# EAGLE design PuggleBoard (EAGLE 6.4)
DATABASE: ./bom/puggleboard_BOM.txt; REVISION: 3.0

## Sheet 1 of 8: BEAGLEBONE PINOUT
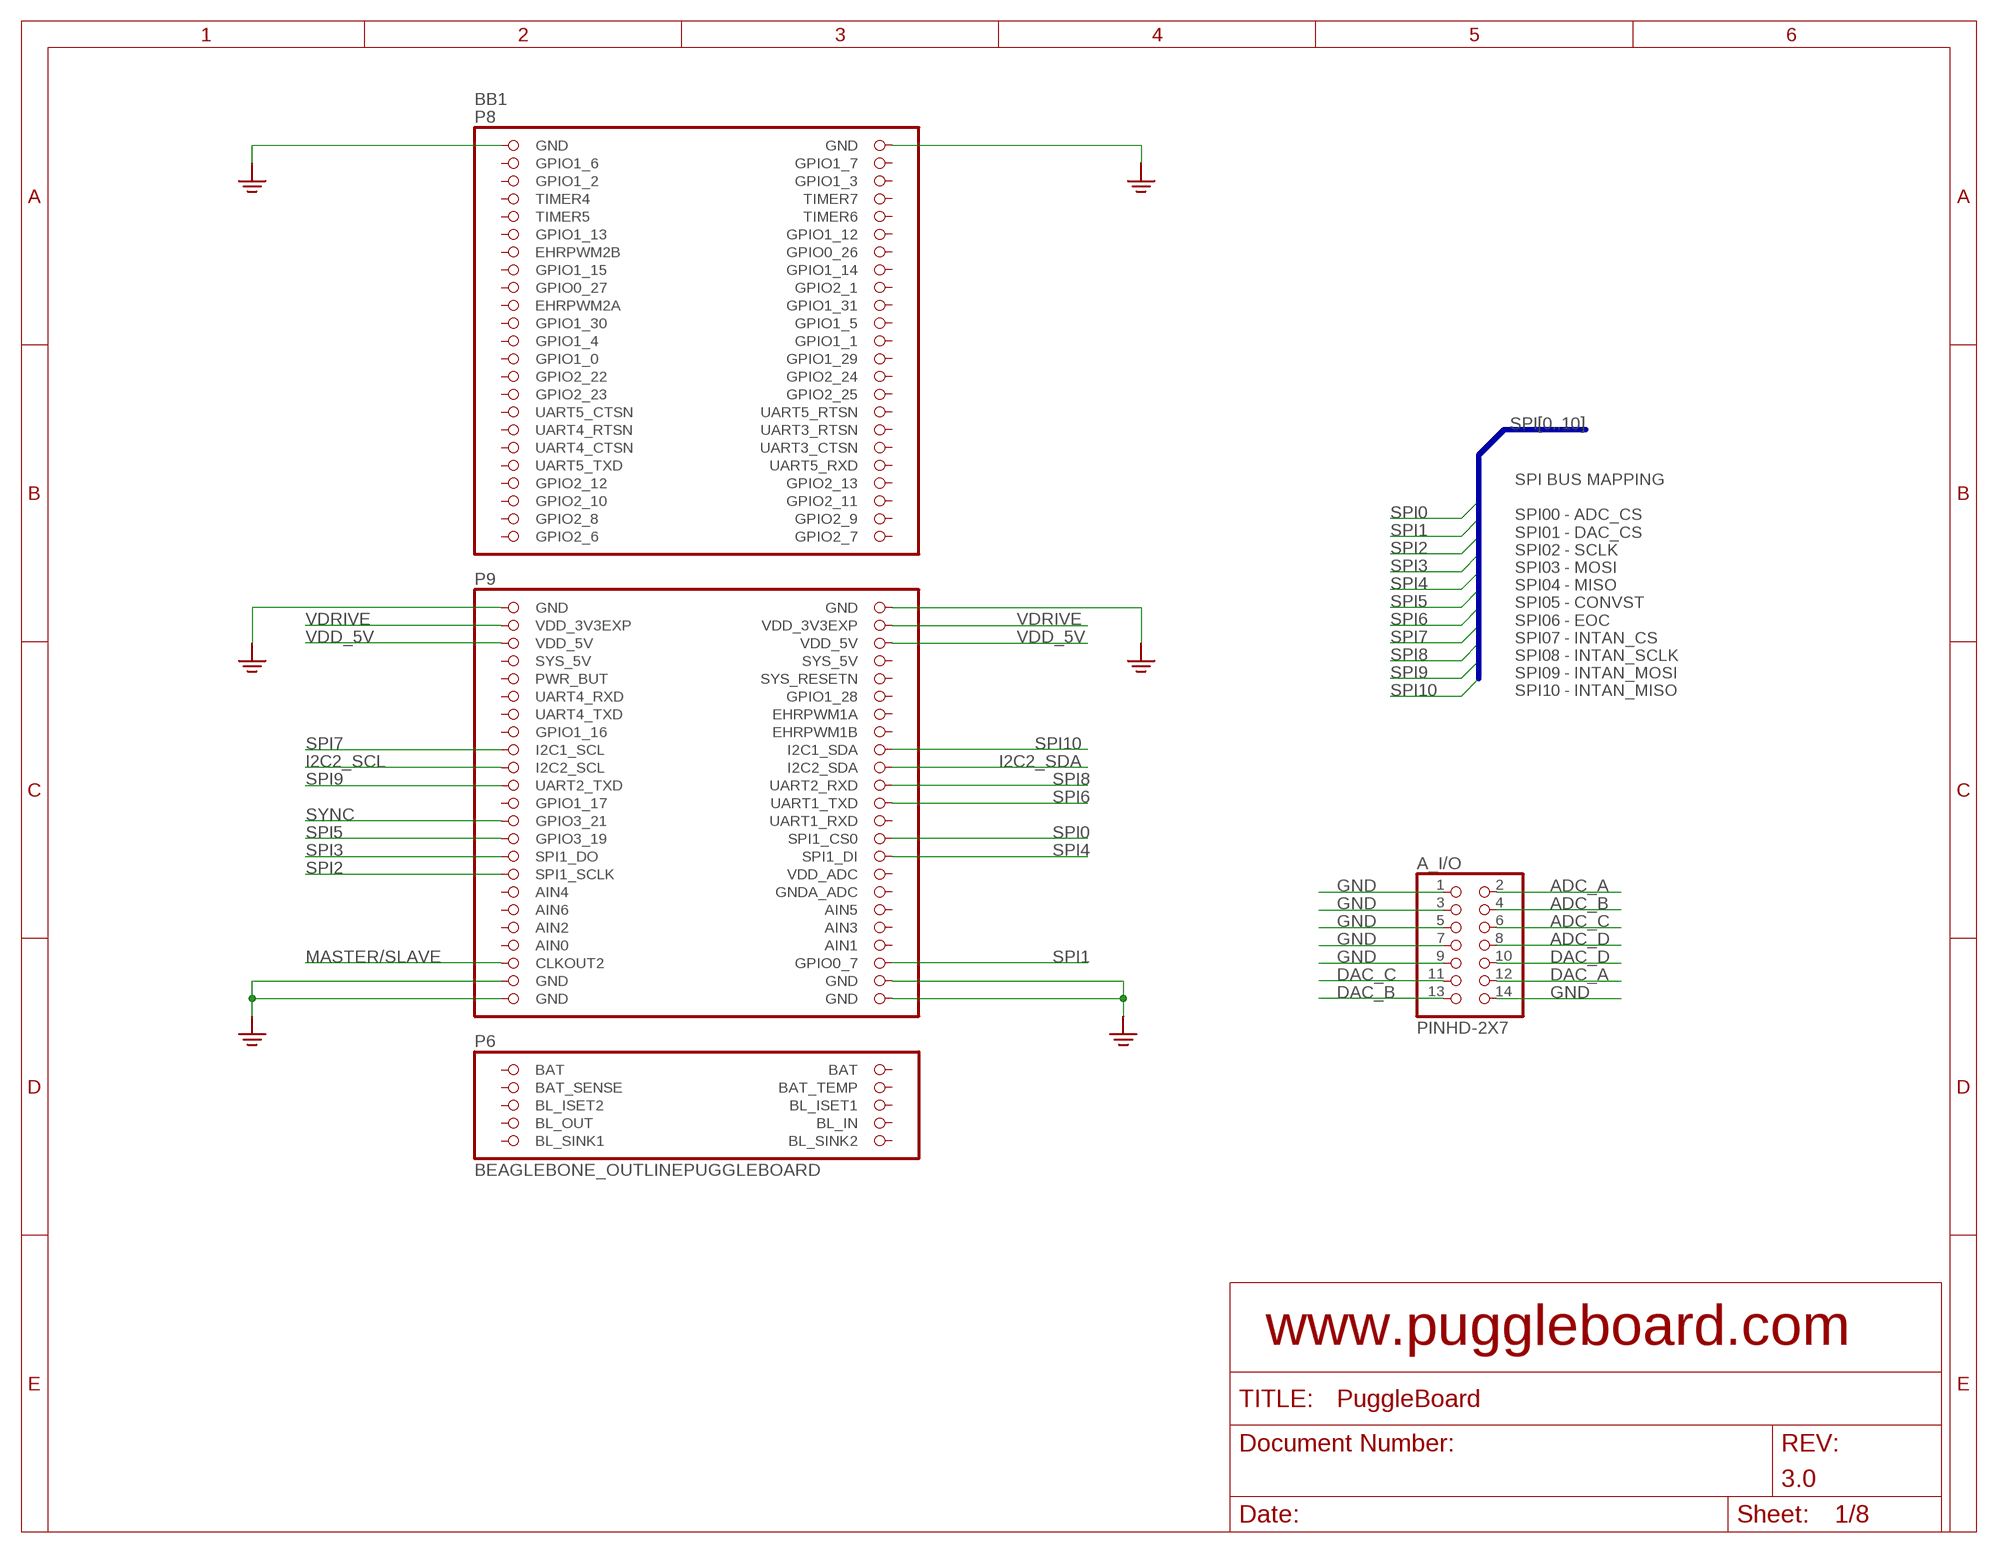
[diagram p0: schematic, sheet 1]

### Parts
A_I/O  PINHD-2X7  [2X07]
BB1  BEAGLEBONE_OUTLINEPUGGLEBOARD  [PUGGLEBOARD_SHIELD]

### Nets
ADC_A: A_I/O.2 ; also sheet 2
ADC_B: A_I/O.4 ; also sheet 2
ADC_C: A_I/O.6 ; also sheet 2
ADC_D: A_I/O.8 ; also sheet 2
DAC_A: A_I/O.12 ; also sheet 3
DAC_B: A_I/O.13 ; also sheet 3
DAC_C: A_I/O.11 ; also sheet 3
DAC_D: A_I/O.10 ; also sheet 3
GND: A_I/O.1 A_I/O.3 A_I/O.5 A_I/O.7 A_I/O.9 A_I/O.14 BB1.1(GND) BB1.2(GND) BB1.47(GND) BB1.48(GND) BB1.89(GND) BB1.90(GND) BB1.91(GND) BB1.92(GND) ; also sheet 2,3,4,5,6,7,8
I2C2_SCL: BB1.65(I2C2_SCL) ; also sheet 8
I2C2_SDA: BB1.66(I2C2_SDA) ; also sheet 8
MASTER/SLAVE: BB1.87(CLKOUT2) ; also sheet 7
SPI0: BB1.74(SPI1_CS0) ; also sheet 2
SPI1: BB1.88(GPIO0_7) ; also sheet 3
SPI2: BB1.77(SPI1_SCLK) ; also sheet 2,3
SPI3: BB1.75(SPI1_DO) ; also sheet 2,3
SPI4: BB1.76(SPI1_DI) ; also sheet 2,3
SPI5: BB1.73(GPIO3_19) ; also sheet 2
SPI6: BB1.70(UART1_TXD) ; also sheet 2
SPI7: BB1.63(I2C1_SCL) ; also sheet 6
SPI8: BB1.68(UART2_RXD) ; also sheet 6
SPI9: BB1.67(UART2_TXD) ; also sheet 6
SPI10: BB1.64(I2C1_SDA) ; also sheet 6
SYNC: BB1.71(GPIO3_21) ; also sheet 7
VDD_5V: BB1.51(VDD_5V) BB1.52(VDD_5V) ; also sheet 4
VDRIVE: BB1.49(VDD_3V3EXP) BB1.50(VDD_3V3EXP) ; also sheet 2,3,4,6,7,8
Unconnected: BB1.3(GPIO1_6) BB1.4(GPIO1_7) BB1.5(GPIO1_2) BB1.6(GPIO1_3) BB1.7(TIMER4) BB1.8(TIMER7) BB1.9(TIMER5) BB1.10(TIMER6) BB1.11(GPIO1_13) BB1.12(GPIO1_12) BB1.13(EHRPWM2B) BB1.14(GPIO0_26) BB1.15(GPIO1_15) BB1.16(GPIO1_14) BB1.17(GPIO0_27) BB1.18(GPIO2_1) BB1.19(EHRPWM2A) BB1.20(GPIO1_31) BB1.21(GPIO1_30) BB1.22(GPIO1_5) BB1.23(GPIO1_4) BB1.24(GPIO1_1) BB1.25(GPIO1_0) BB1.26(GPIO1_29) BB1.27(GPIO2_22) BB1.28(GPIO2_24) BB1.29(GPIO2_23) BB1.30(GPIO2_25) BB1.31(UART5_CTSN) BB1.32(UART5_RTSN) BB1.33(UART4_RTSN) BB1.34(UART3_RTSN) BB1.35(UART4_CTSN) BB1.36(UART3_CTSN) BB1.37(UART5_TXD) BB1.38(UART5_RXD) BB1.39(GPIO2_12) BB1.40(GPIO2_13) BB1.41(GPIO2_10) BB1.42(GPIO2_11) BB1.43(GPIO2_8) BB1.44(GPIO2_9) BB1.45(GPIO2_6) BB1.46(GPIO2_7) BB1.53(SYS_5V) BB1.54(SYS_5V) BB1.55(PWR_BUT) BB1.56(SYS_RESETN) BB1.57(UART4_RXD) BB1.58(GPIO1_28) BB1.59(UART4_TXD) BB1.60(EHRPWM1A) BB1.61(GPIO1_16) BB1.62(EHRPWM1B) BB1.69(GPIO1_17) BB1.72(UART1_RXD) BB1.78(VDD_ADC) BB1.79(AIN4) BB1.80(GNDA_ADC) BB1.81(AIN6) BB1.82(AIN5) BB1.83(AIN2) BB1.84(AIN3) BB1.85(AIN0) BB1.86(AIN1) BB1.93(BAT) BB1.94(BAT) BB1.96(BAT_TEMP) BB1.98(BL_ISET1) BB1.99(BL_ISET2)

### Buses
SPI[0..10]

### Notes on the sheet
- SPI BUS MAPPING
  
  SPI00 - ADC_CS
  SPI01 - DAC_CS
  SPI02 - SCLK
  SPI03 - MOSI
  SPI04 - MISO
  SPI05 - CONVST
  SPI06 - EOC
  SPI07 - INTAN_CS
  SPI08 - INTAN_SCLK
  SPI09 - INTAN_MOSI
  SPI10 - INTAN_MISO

## Sheet 2 of 8: ADC
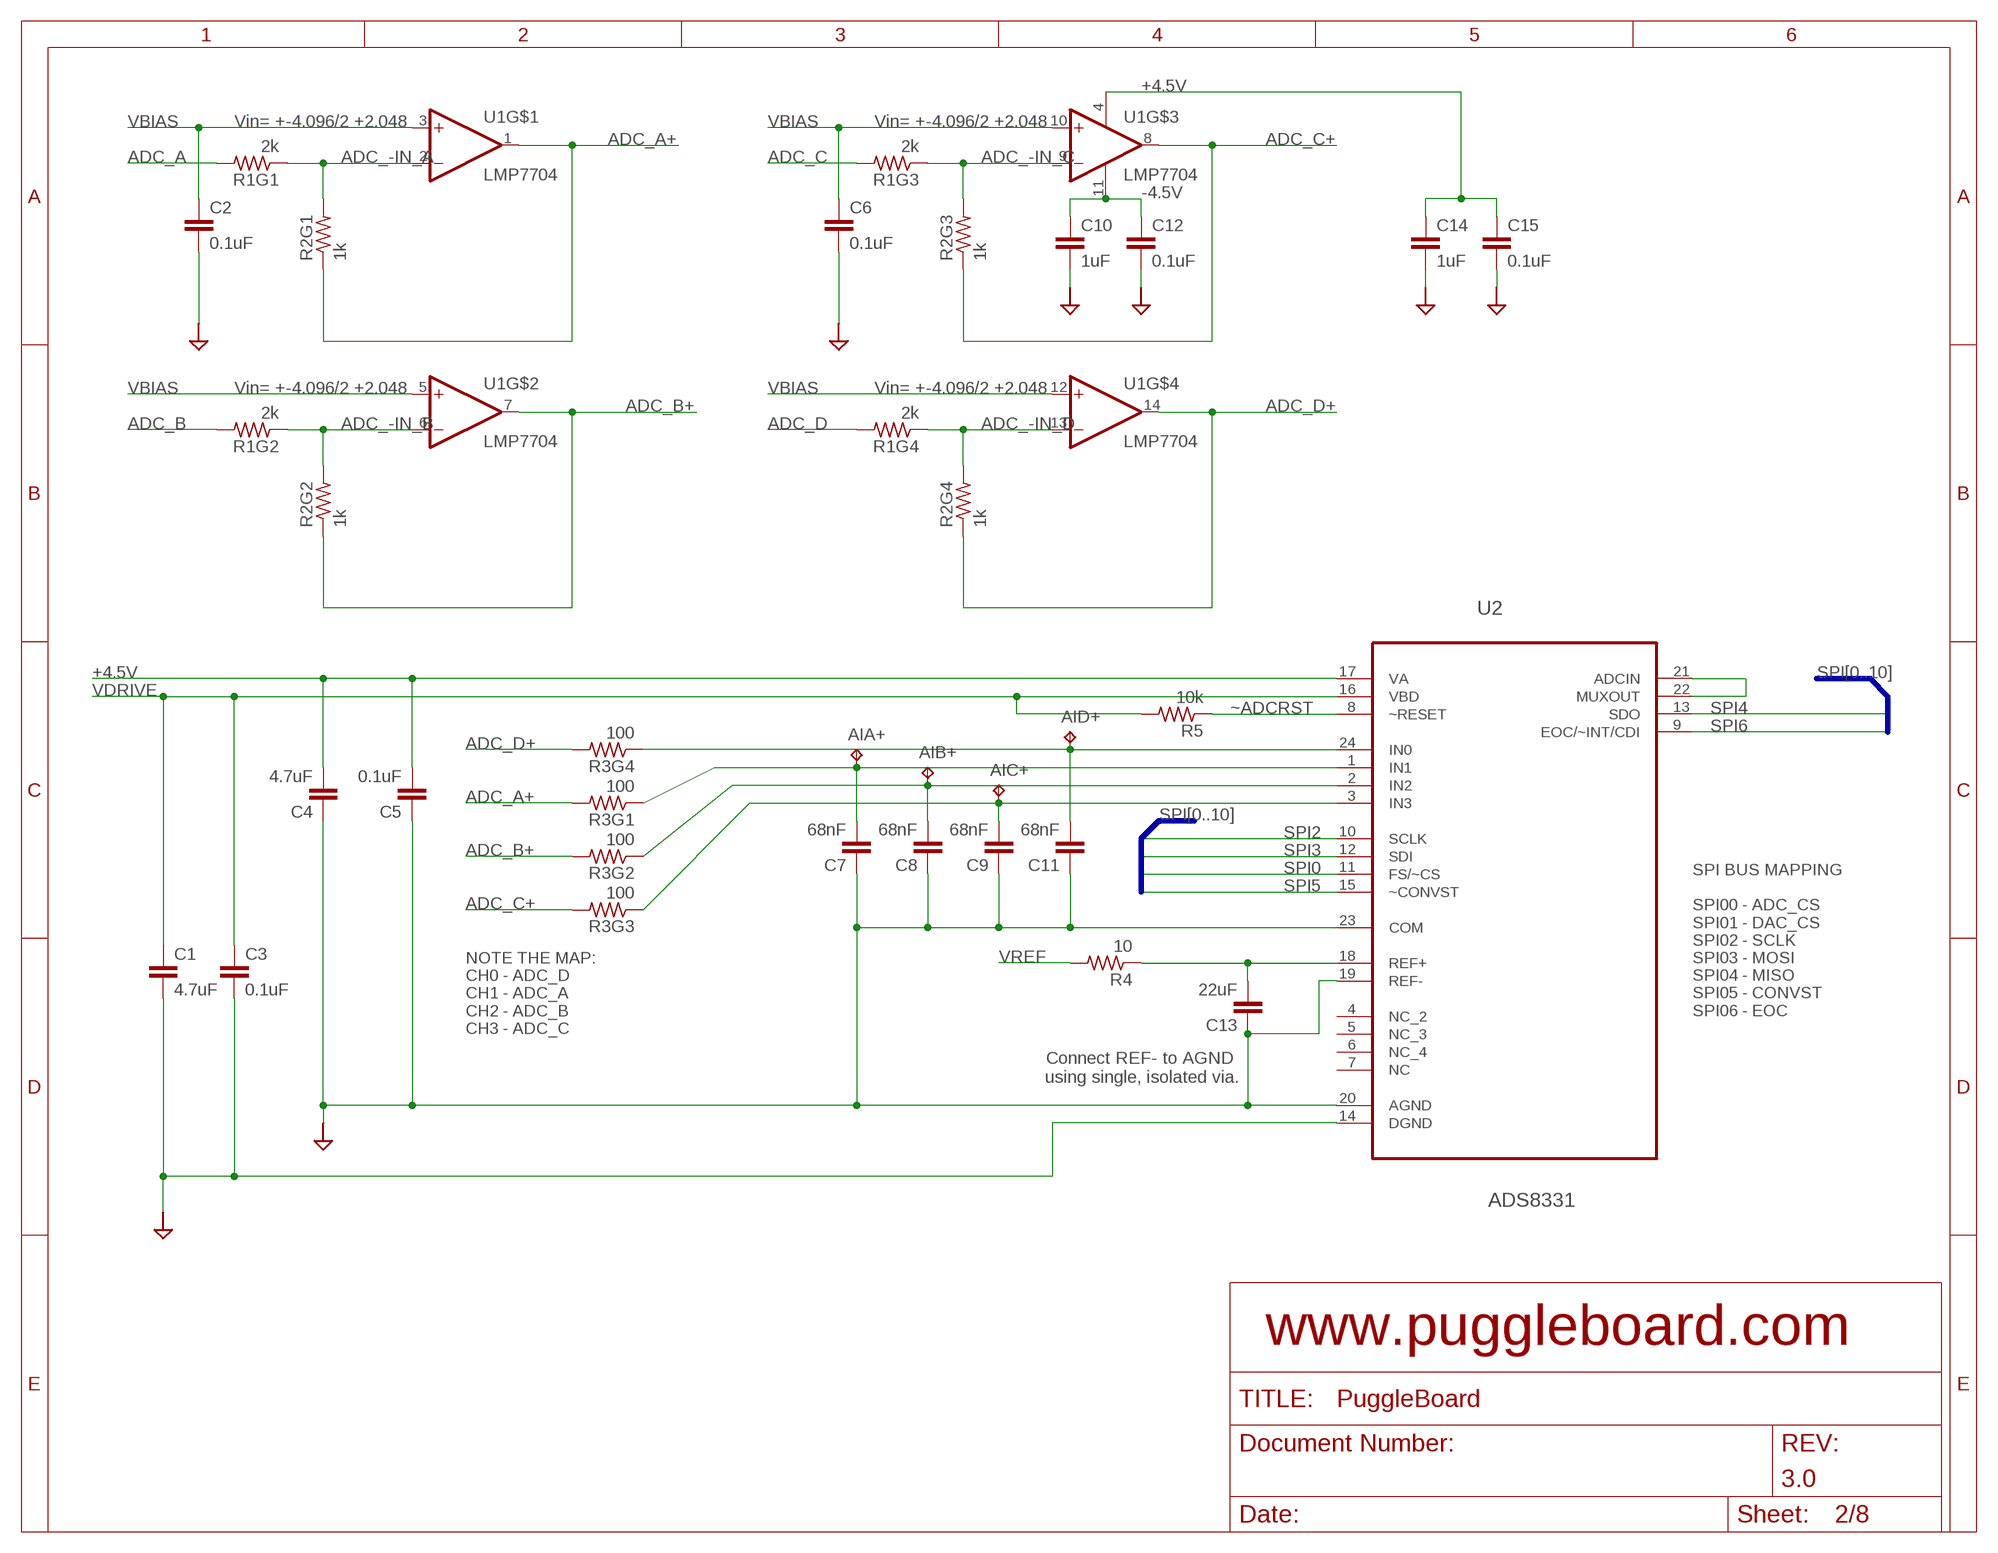
[diagram p1: schematic, sheet 2]

### Parts
AIA+  TPB1,27  [B1,27]
AIB+  TPB1,27  [B1,27]
AIC+  TPB1,27  [B1,27]
AID+  TPB1,27  [B1,27]
C1  4.7uF  C_0603  [0603]
C2  0.1uF  C_0603  [0603]
C3  0.1uF  C_0603  [0603]
C4  4.7uF  C_0603  [0603]
C5  0.1uF  C_0603  [0603]
C6  0.1uF  C_0603  [0603]
C7  68nF  C_0603  [0603]
C8  68nF  C_0603  [0603]
C9  68nF  C_0603  [0603]
C10  1uF  C_0603  [0603]
C11  68nF  C_0603  [0603]
C12  0.1uF  C_0603  [0603]
C13  22uF  C_0805  [0805]
C14  1uF  C_0603  [0603]
C15  0.1uF  C_0603  [0603]
R1  2k  RX4_0612  [RX4_0612]
R2  1k  RX4_0612  [RX4_0612]
R3  100  RX4_0612  [RX4_0612]
R4  10  R_0603  [0603]
R5  10k  R_0603  [0603]
U1  LMP7704  LMP7704MOD  [SOP65P640X120-14N-MOD]
U2  ADS8331  ADS8331IBPW  [SOP65P640X120-24N]

### Nets
+4.5V: C4.2 C5.2 C14.1 C15.1 U1.4(V+) U2.17(VA) ; also sheet 3,4,5
-4.5V: C10.1 C12.1 U1.11(V-) ; also sheet 3,4
ADC_-IN_A: R1.P1 R2.P2 U1.2(-IN)
ADC_-IN_B: R1.P3 R2.P4 U1.6(-IN)
ADC_-IN_C: R1.P5 R2.P6 U1.9(-IN)
ADC_-IN_D: R1.P7 R2.P8 U1.13(-IN)
ADC_A: R1.P2 ; also sheet 1
ADC_A+: R2.P1 R3.P2 U1.1(OUT)
ADC_B: R1.P4 ; also sheet 1
ADC_B+: R2.P3 R3.P4 U1.7(OUT)
ADC_C: R1.P6 ; also sheet 1
ADC_C+: R2.P5 R3.P6 U1.8(OUT)
ADC_D: R1.P8 ; also sheet 1
ADC_D+: R2.P7 R3.P8 U1.14(OUT)
GND: C1.2 C2.2 C3.2 C4.1 C5.1 C6.2 C7.1 C8.1 C9.1 C10.2 C11.1 C12.2 C13.1 C14.2 C15.2 U2.14(DGND) U2.19(REF-) U2.20(AGND) U2.23(COM) ; also sheet 1,3,4,5,6,7,8
N$3: U2.21(ADCIN) U2.22(MUXOUT)
N$16: C13.2 R4.1 U2.18(REF+)
N$40: AIA+.TP C7.2 R3.P1 U2.1(IN1)
N$41: AIB+.TP C8.2 R3.P3 U2.2(IN2)
N$42: AIC+.TP C9.2 R3.P5 U2.3(IN3)
N$43: AID+.TP C11.2 R3.P7 U2.24(IN0)
SPI0: U2.11(FS/~CS) ; also sheet 1
SPI2: U2.10(SCLK) ; also sheet 1,3
SPI3: U2.12(SDI) ; also sheet 1,3
SPI4: U2.13(SDO) ; also sheet 1,3
SPI5: U2.15(~CONVST) ; also sheet 1
SPI6: U2.9(EOC/~INT/CDI) ; also sheet 1
VBIAS: C2.1 C6.1 U1.3(+IN) U1.5(+IN) U1.10(+IN) U1.12(+IN) ; also sheet 5
VDRIVE: C1.1 C3.1 R5.2 U2.16(VBD) ; also sheet 1,3,4,6,7,8
VREF: R4.2 ; also sheet 3,5
~ADCRST: R5.1 U2.8(~RESET)
Unconnected: U2.4(NC_2) U2.5(NC_3) U2.6(NC_4) U2.7(NC)

### Buses
SPI[0..10]

### Notes on the sheet
- Vin= +-4.096/2 +2.048 | Vin= +-4.096/2 +2.048
- Vin= +-4.096/2 +2.048 | Vin= +-4.096/2 +2.048
- SPI BUS MAPPING
  
  SPI00 - ADC_CS
  SPI01 - DAC_CS
  SPI02 - SCLK
  SPI03 - MOSI
  SPI04 - MISO
  SPI05 - CONVST
  SPI06 - EOC
- NOTE THE MAP:
  CH0 - ADC_D
  CH1 - ADC_A
  CH2 - ADC_B
  CH3 - ADC_C
- Connect REF- to AGND 
  using single, isolated via.

## Sheet 3 of 8: DAC
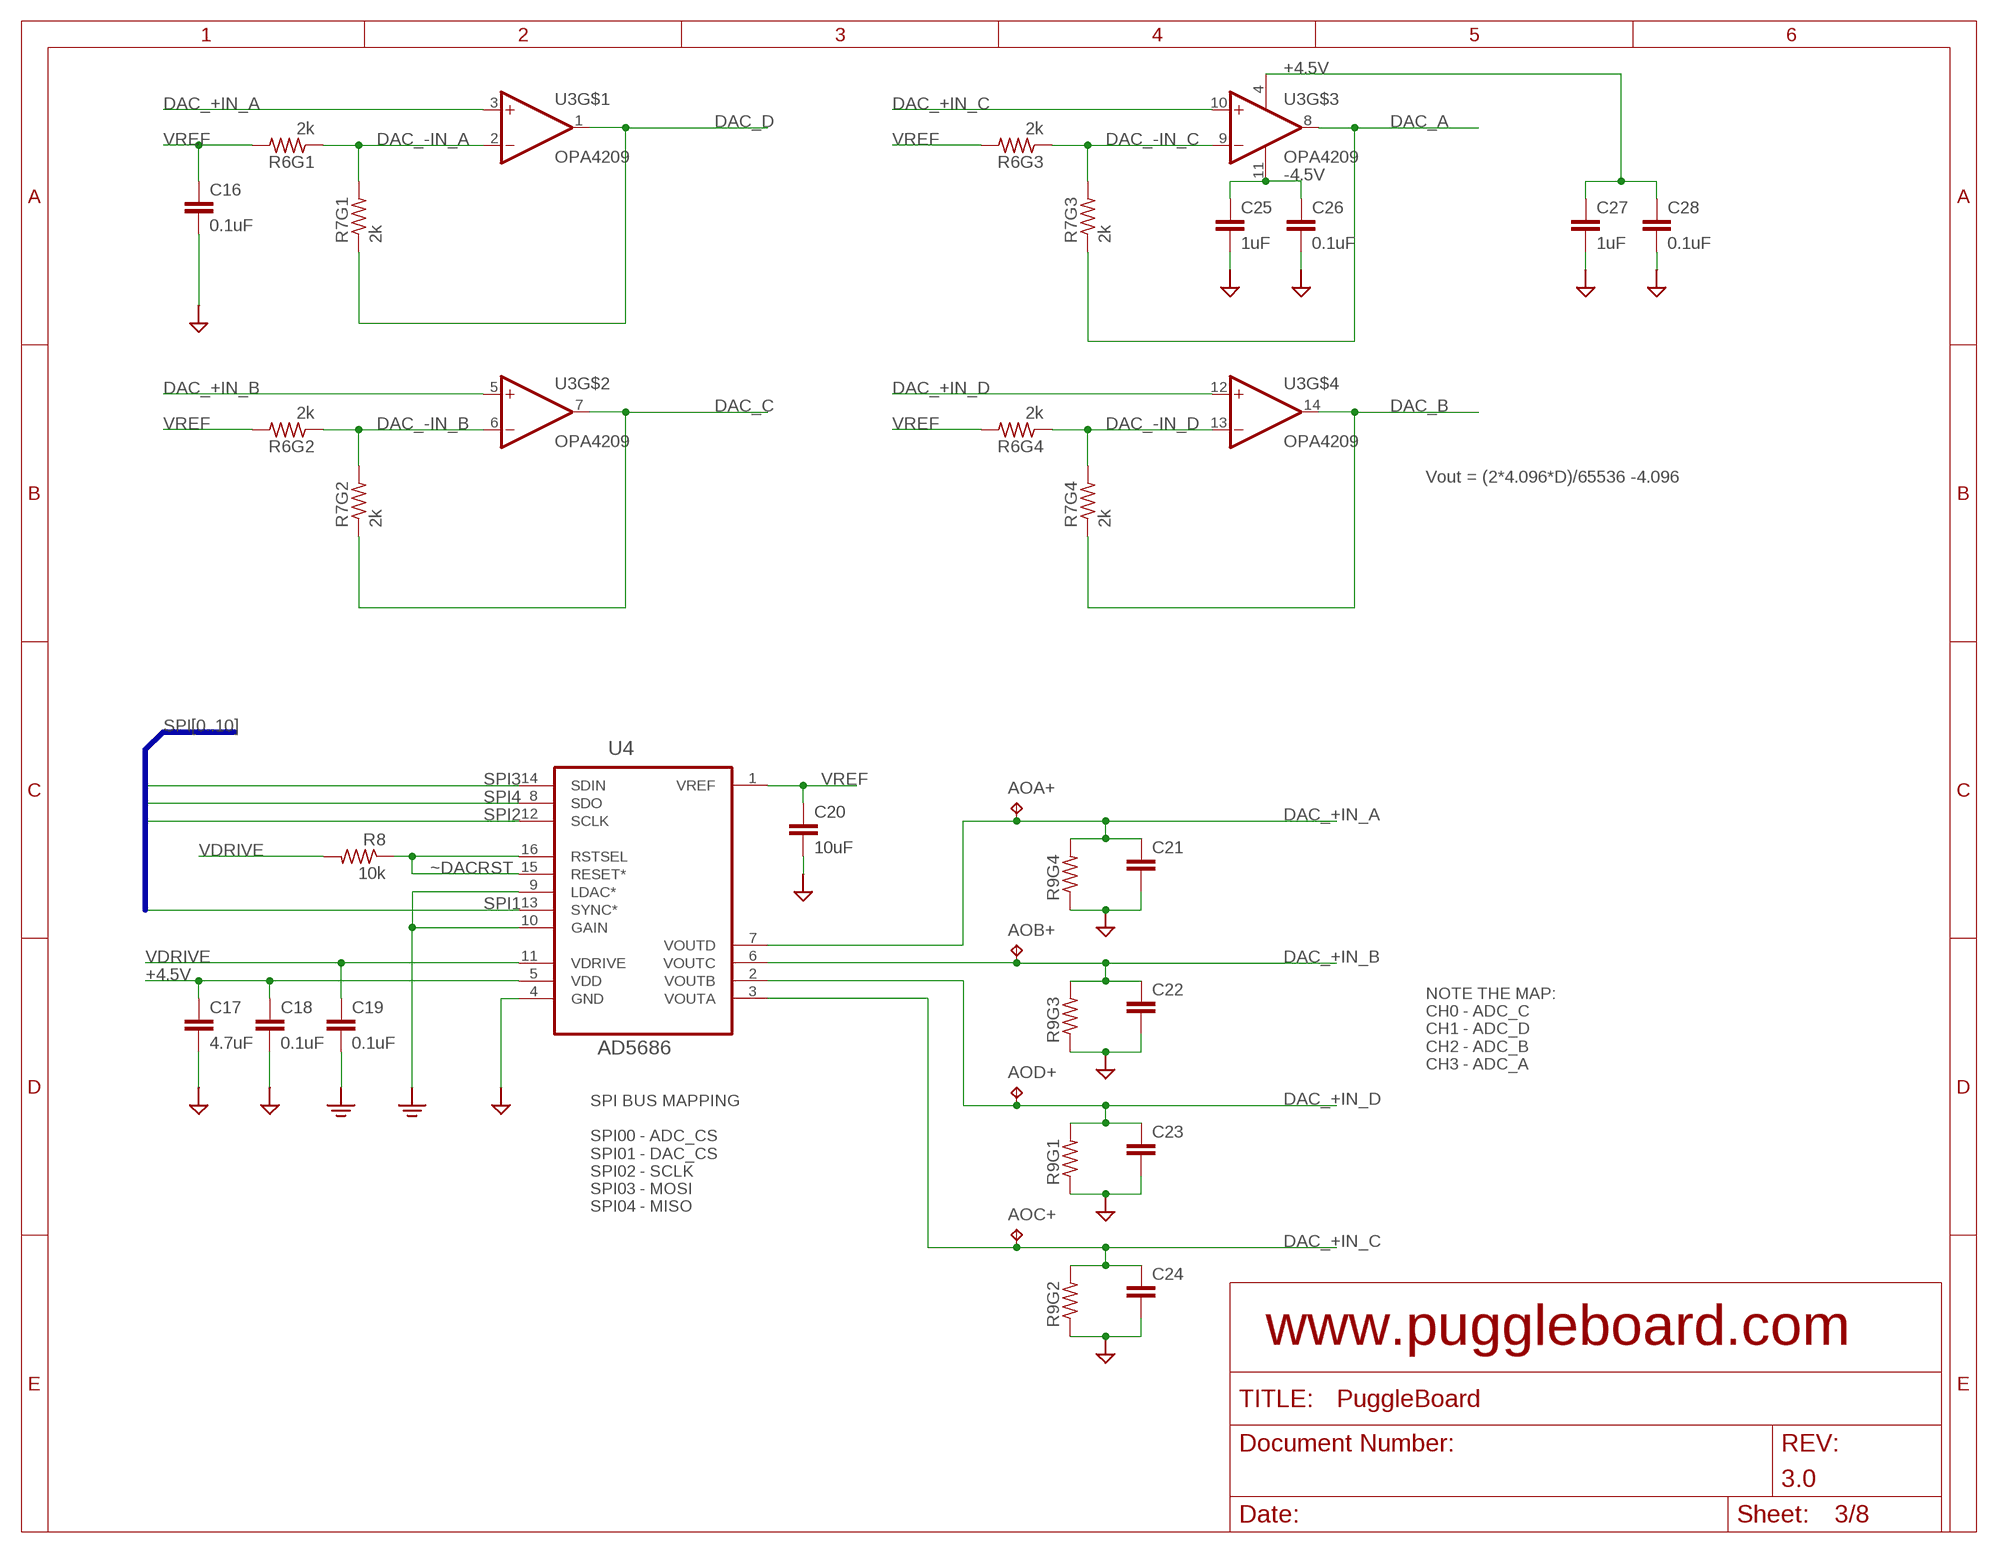
[diagram p2: schematic, sheet 3]

### Parts
AOA+  TPB1,27  [B1,27]
AOB+  TPB1,27  [B1,27]
AOC+  TPB1,27  [B1,27]
AOD+  TPB1,27  [B1,27]
C16  0.1uF  C_0603  [0603]
C17  4.7uF  C_0603  [0603]
C18  0.1uF  C_0603  [0603]
C19  0.1uF  C_0603  [0603]
C20  10uF  C_0805  [0805]
C21  C_0603  [0603]
C22  C_0603  [0603]
C23  C_0603  [0603]
C24  C_0603  [0603]
C25  1uF  C_0603  [0603]
C26  0.1uF  C_0603  [0603]
C27  1uF  C_0603  [0603]
C28  0.1uF  C_0603  [0603]
R6  2k  RX4_0612  [RX4_0612]
R7  2k  RX4_0612  [RX4_0612]
R8  10k  R_0603  [0603]
R9  RX4_0612  [RX4_0612]
U3  OPA4209  OPA4209AIPWMOD  [SOP65P640X120-14N-MOD]
U4  AD5686  AD5686RARUZ  [MO-153-AB]

### Nets
+4.5V: C17.1 C18.1 C27.1 C28.1 U3.4(V+) U4.5(VDD) ; also sheet 2,4,5
-4.5V: C25.1 C26.1 U3.11(V-) ; also sheet 2,4
DAC_+IN_A: AOA+.TP C21.1 R9.P8 U3.3(+IN) U4.7(VOUTD)
DAC_+IN_B: AOB+.TP C22.1 R9.P6 U3.5(+IN) U4.6(VOUTC)
DAC_+IN_C: AOC+.TP C24.1 R9.P4 U3.10(+IN) U4.3(VOUTA)
DAC_+IN_D: AOD+.TP C23.1 R9.P2 U3.12(+IN) U4.2(VOUTB)
DAC_-IN_A: R6.P1 R7.P2 U3.2(-IN)
DAC_-IN_B: R6.P3 R7.P4 U3.6(-IN)
DAC_-IN_C: R6.P5 R7.P6 U3.9(-IN)
DAC_-IN_D: R6.P7 R7.P8 U3.13(-IN)
DAC_A: R7.P5 U3.8(OUT) ; also sheet 1
DAC_B: R7.P7 U3.14(OUT) ; also sheet 1
DAC_C: R7.P3 U3.7(OUT) ; also sheet 1
DAC_D: R7.P1 U3.1(OUT) ; also sheet 1
GND: C16.2 C17.2 C18.2 C19.2 C20.2 C21.2 C22.2 C23.2 C24.2 C25.2 C26.2 C27.2 C28.2 R9.P1 R9.P3 R9.P5 R9.P7 U4.4(GND) U4.9(LDAC*) U4.10(GAIN) ; also sheet 1,2,4,5,6,7,8
SPI1: U4.13(SYNC*) ; also sheet 1
SPI2: U4.12(SCLK) ; also sheet 1,2
SPI3: U4.14(SDIN) ; also sheet 1,2
SPI4: U4.8(SDO) ; also sheet 1,2
VDRIVE: C19.1 R8.2 U4.11(VDRIVE) ; also sheet 1,2,4,6,7,8
VREF: C16.1 C20.1 R6.P2 R6.P4 R6.P6 R6.P8 U4.1(VREF) ; also sheet 2,5
~DACRST: R8.1 U4.15(RESET*) U4.16(RSTSEL)

### Buses
SPI[0..10]

### Notes on the sheet
- Vout = (2*4.096*D)/65536 -4.096
- NOTE THE MAP:
  CH0 - ADC_C
  CH1 - ADC_D
  CH2 - ADC_B
  CH3 - ADC_A
- SPI BUS MAPPING
  
  SPI00 - ADC_CS
  SPI01 - DAC_CS
  SPI02 - SCLK
  SPI03 - MOSI
  SPI04 - MISO

## Sheet 4 of 8: POWER
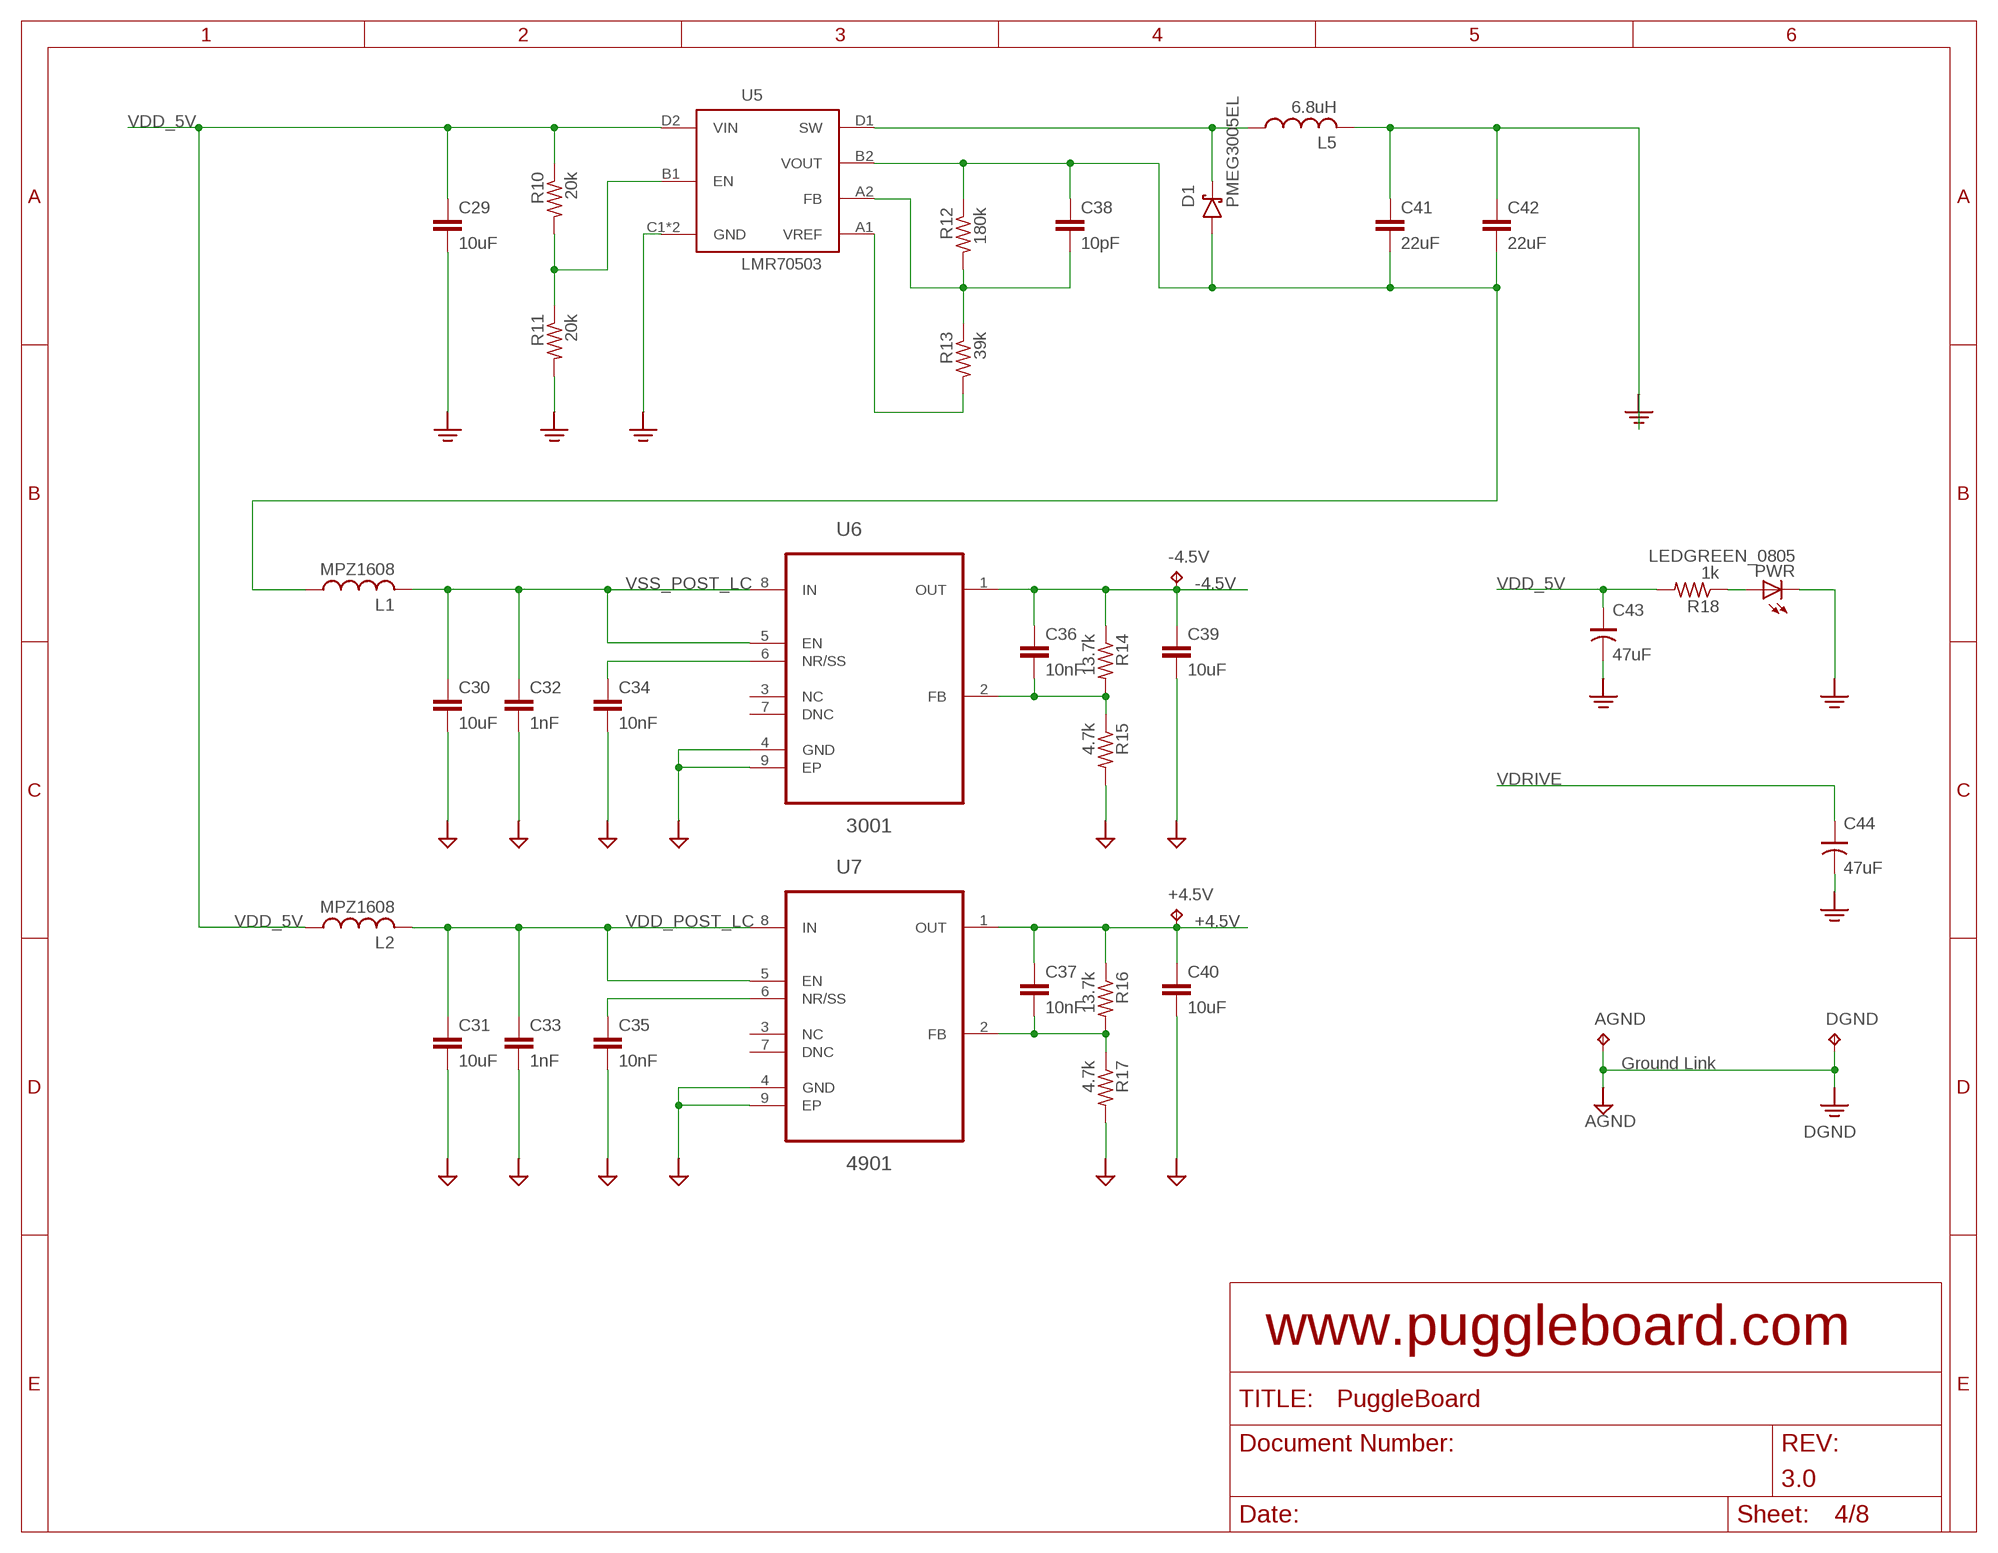
[diagram p3: schematic, sheet 4]

### Parts
+4.5V  TPPAD1-17  [P1-17]
-4.5V  TPPAD1-17  [P1-17]
AGND  TPPAD1-17  [P1-17]
C29  10uF  C_0603  [0603]
C30  10uF  C_1206  [1206]
C31  10uF  C_1206  [1206]
C32  1nF  C_0603  [0603]
C33  1nF  C_0603  [0603]
C34  10nF  C_0603  [0603]
C35  10nF  C_0603  [0603]
C36  10nF  C_0603  [0603]
C37  10nF  C_0603  [0603]
C38  10pF  C_0402  [0402]
C39  10uF  C_1206  [1206]
C40  10uF  C_1206  [1206]
C41  22uF  C_0603  [0603]
C42  22uF  C_0603  [0603]
C43  47uF  C-POL_0807  [153CLV-0807]
C44  47uF  C-POL_0807  [153CLV-0807]
D1  PMEG3005EL  S-DIODE_SOD882  [SOD882]
DGND  TPPAD1-17  [P1-17]
L1  MPZ1608  L_0603  [0603]
L2  MPZ1608  L_0603  [0603]
L5  6.8uH  L_VLS2012E  [VLS2012E]
PWR  LEDGREEN_0805  [CHIP-LED0805]
R10  20k  R_0402  [0402]
R11  20k  R_0402  [0402]
R12  180k  R_0402  [0402]
R13  39k  R_0402  [0402]
R14  13.7k  R_0603  [0603]
R15  4.7k  R_0603  [0603]
R16  13.7k  R_0603  [0603]
R17  4.7k  R_0603  [0603]
R18  1k  R_0603  [0603]
U5  LMR70503  [8BGA]
U6  3001  TPS7A3001DGNR  [SOP65P490X110-9N]
U7  4901  TPS7A4901DGNR  [SOP65P490X110-9N]

### Nets
+4.5V: +4.5V.TP C37.1 C40.1 R16.1 U7.1(OUT) ; also sheet 2,3,5
-4.5V: -4.5V.TP C36.1 C39.1 R14.1 U6.1(OUT) ; also sheet 2,3
AGND1: C37.2 R16.2 R17.1 U7.2(FB)
AGND2: C36.2 R14.2 R15.1 U6.2(FB)
GND: AGND.TP C29.2 C30.2 C31.2 C32.2 C33.2 C34.2 C35.2 C39.2 C40.2 C41.1 C42.1 C43.- C44.- DGND.TP L5.2 PWR.C R11.2 R15.2 R17.2 U5.C1(GND) U5.C2(GND) U6.4(GND) U6.9(EP) U7.4(GND) U7.9(EP) ; also sheet 1,2,3,5,6,7,8
N$1: C35.1 U7.6(NR/SS)
N$2: C34.1 U6.6(NR/SS)
N$7: R10.2 R11.1 U5.B1(EN)
N$17: C38.2 R12.2 R13.1 U5.A2(FB)
N$20: PWR.A R18.1
N$23: R13.2 U5.A1(VREF)
SW: D1.C L5.1 U5.D1(SW)
VDD_5V: C29.1 C43.+ L2.1 R10.1 R18.2 U5.D2(VIN) ; also sheet 1
VDD_POST_LC: C31.1 C33.1 L2.2 U7.5(EN) U7.8(IN)
VDRIVE: C44.+ ; also sheet 1,2,3,6,7,8
VOUT-: C38.1 C41.2 C42.2 D1.A L1.1 R12.1 U5.B2(VOUT)
VSS_POST_LC: C30.1 C32.1 L1.2 U6.5(EN) U6.8(IN)
Unconnected: U6.3(NC) U6.7(DNC) U7.3(NC) U7.7(DNC)

### Notes on the sheet
- Ground Link

## Sheet 5 of 8: VREF
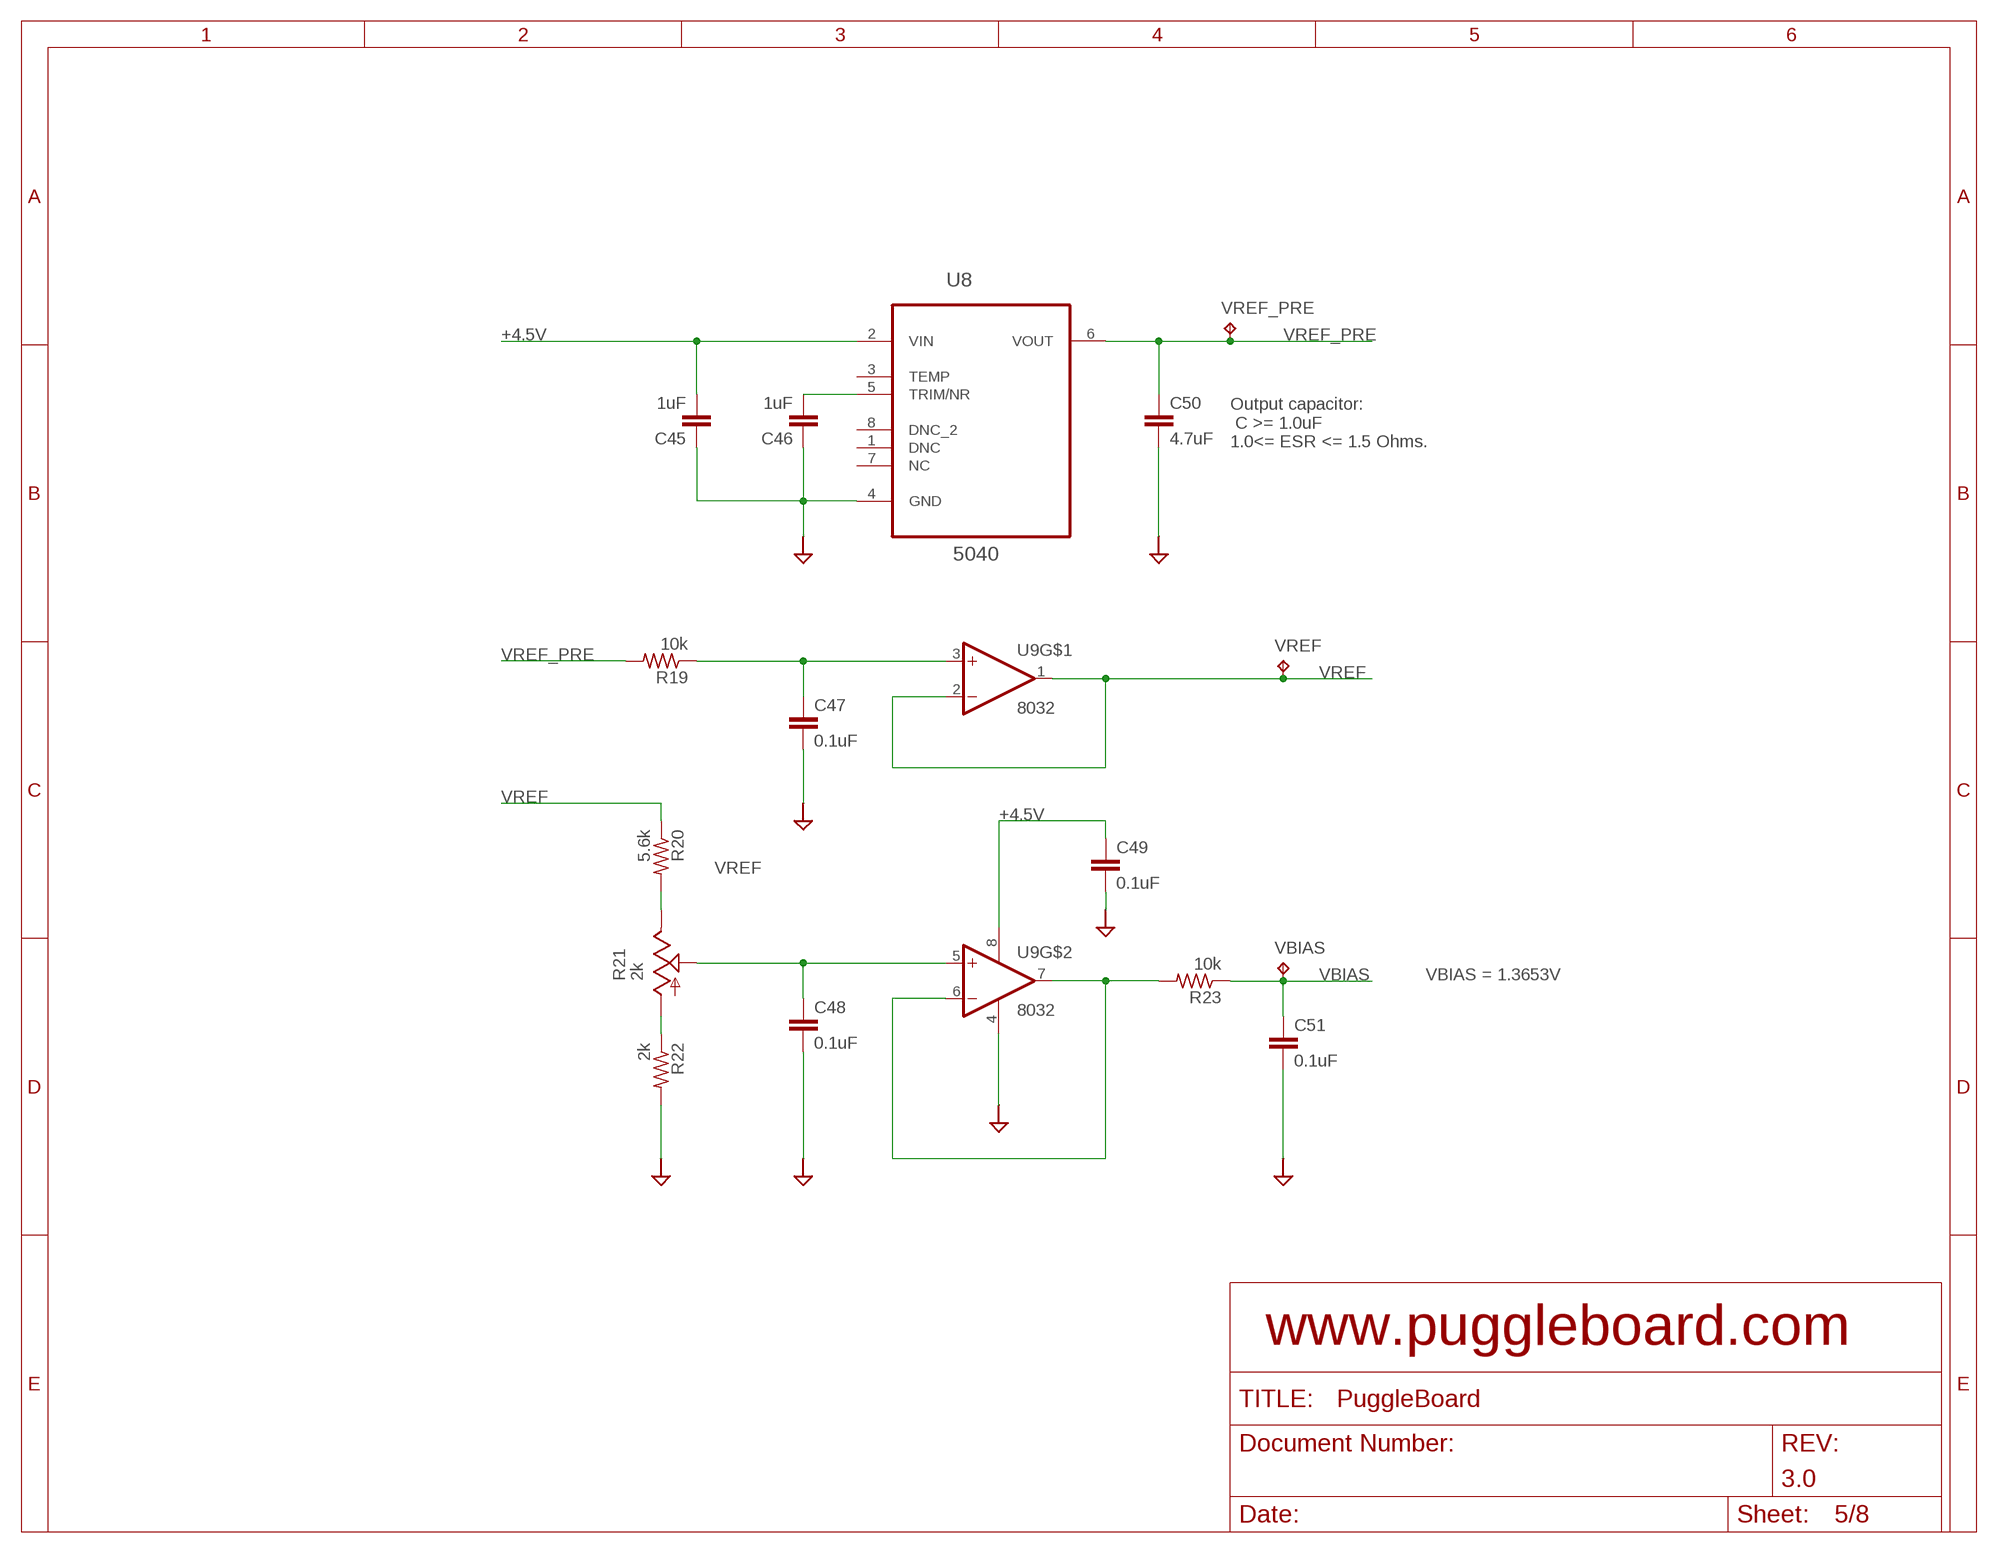
[diagram p4: schematic, sheet 5]

### Parts
C45  1uF  C_0603  [0603]
C46  1uF  C_0603  [0603]
C47  0.1uF  C_0603  [0603]
C48  0.1uF  C_0603  [0603]
C49  0.1uF  C_0603  [0603]
C50  4.7uF  C_1206  [1206]
C51  0.1uF  C_0603  [0603]
R19  10k  R_0603  [0603]
R20  5.6k  R_0603  [0603]
R21  2k  TRIM_US-SM-42/43W  [SM-42/43W]
R22  2k  R_0603  [0603]
R23  10k  R_0603  [0603]
U8  5040  REF5040MDREP_SOP  [SOP65P490X110-8N]
U9  8032  AD8032ARZ-REEL7_SOP  [SOP65P490X110-8N]
VBIAS  TPB1,27  [B1,27]
VREF  TPB1,27  [B1,27]
VREF_PRE  TPB1,27  [B1,27]

### Nets
+4.5V: C45.2 C49.1 U8.2(VIN) U9.8(V+) ; also sheet 2,3,4
GND: C45.1 C46.1 C47.2 C48.2 C49.2 C50.2 C51.2 R22.2 U8.4(GND) U9.4(V-) ; also sheet 1,2,3,4,6,7,8
N$4: C48.1 R21.2(S) U9.5(+IN)
N$8: R21.1(A) R22.1
N$9: R23.2 U9.6(-IN) U9.7(OUT)
N$10: R20.2 R21.3(E)
N$28: C47.1 R19.1 U9.3(+IN)
N$32: C46.2 U8.5(TRIM/NR)
VBIAS: C51.1 R23.1 VBIAS.TP ; also sheet 2
VREF: R20.1 U9.1(OUT) U9.2(-IN) VREF.TP ; also sheet 2,3
VREF_PRE: C50.1 R19.2 U8.6(VOUT) VREF_PRE.TP
Unconnected: U8.1(DNC) U8.3(TEMP) U8.7(NC) U8.8(DNC_2)

### Notes on the sheet
- Output capacitor:
   C >= 1.0uF 
  1.0<= ESR <= 1.5 Ohms.
- VBIAS = 1.3653V

## Sheet 6 of 8: LVDS IO
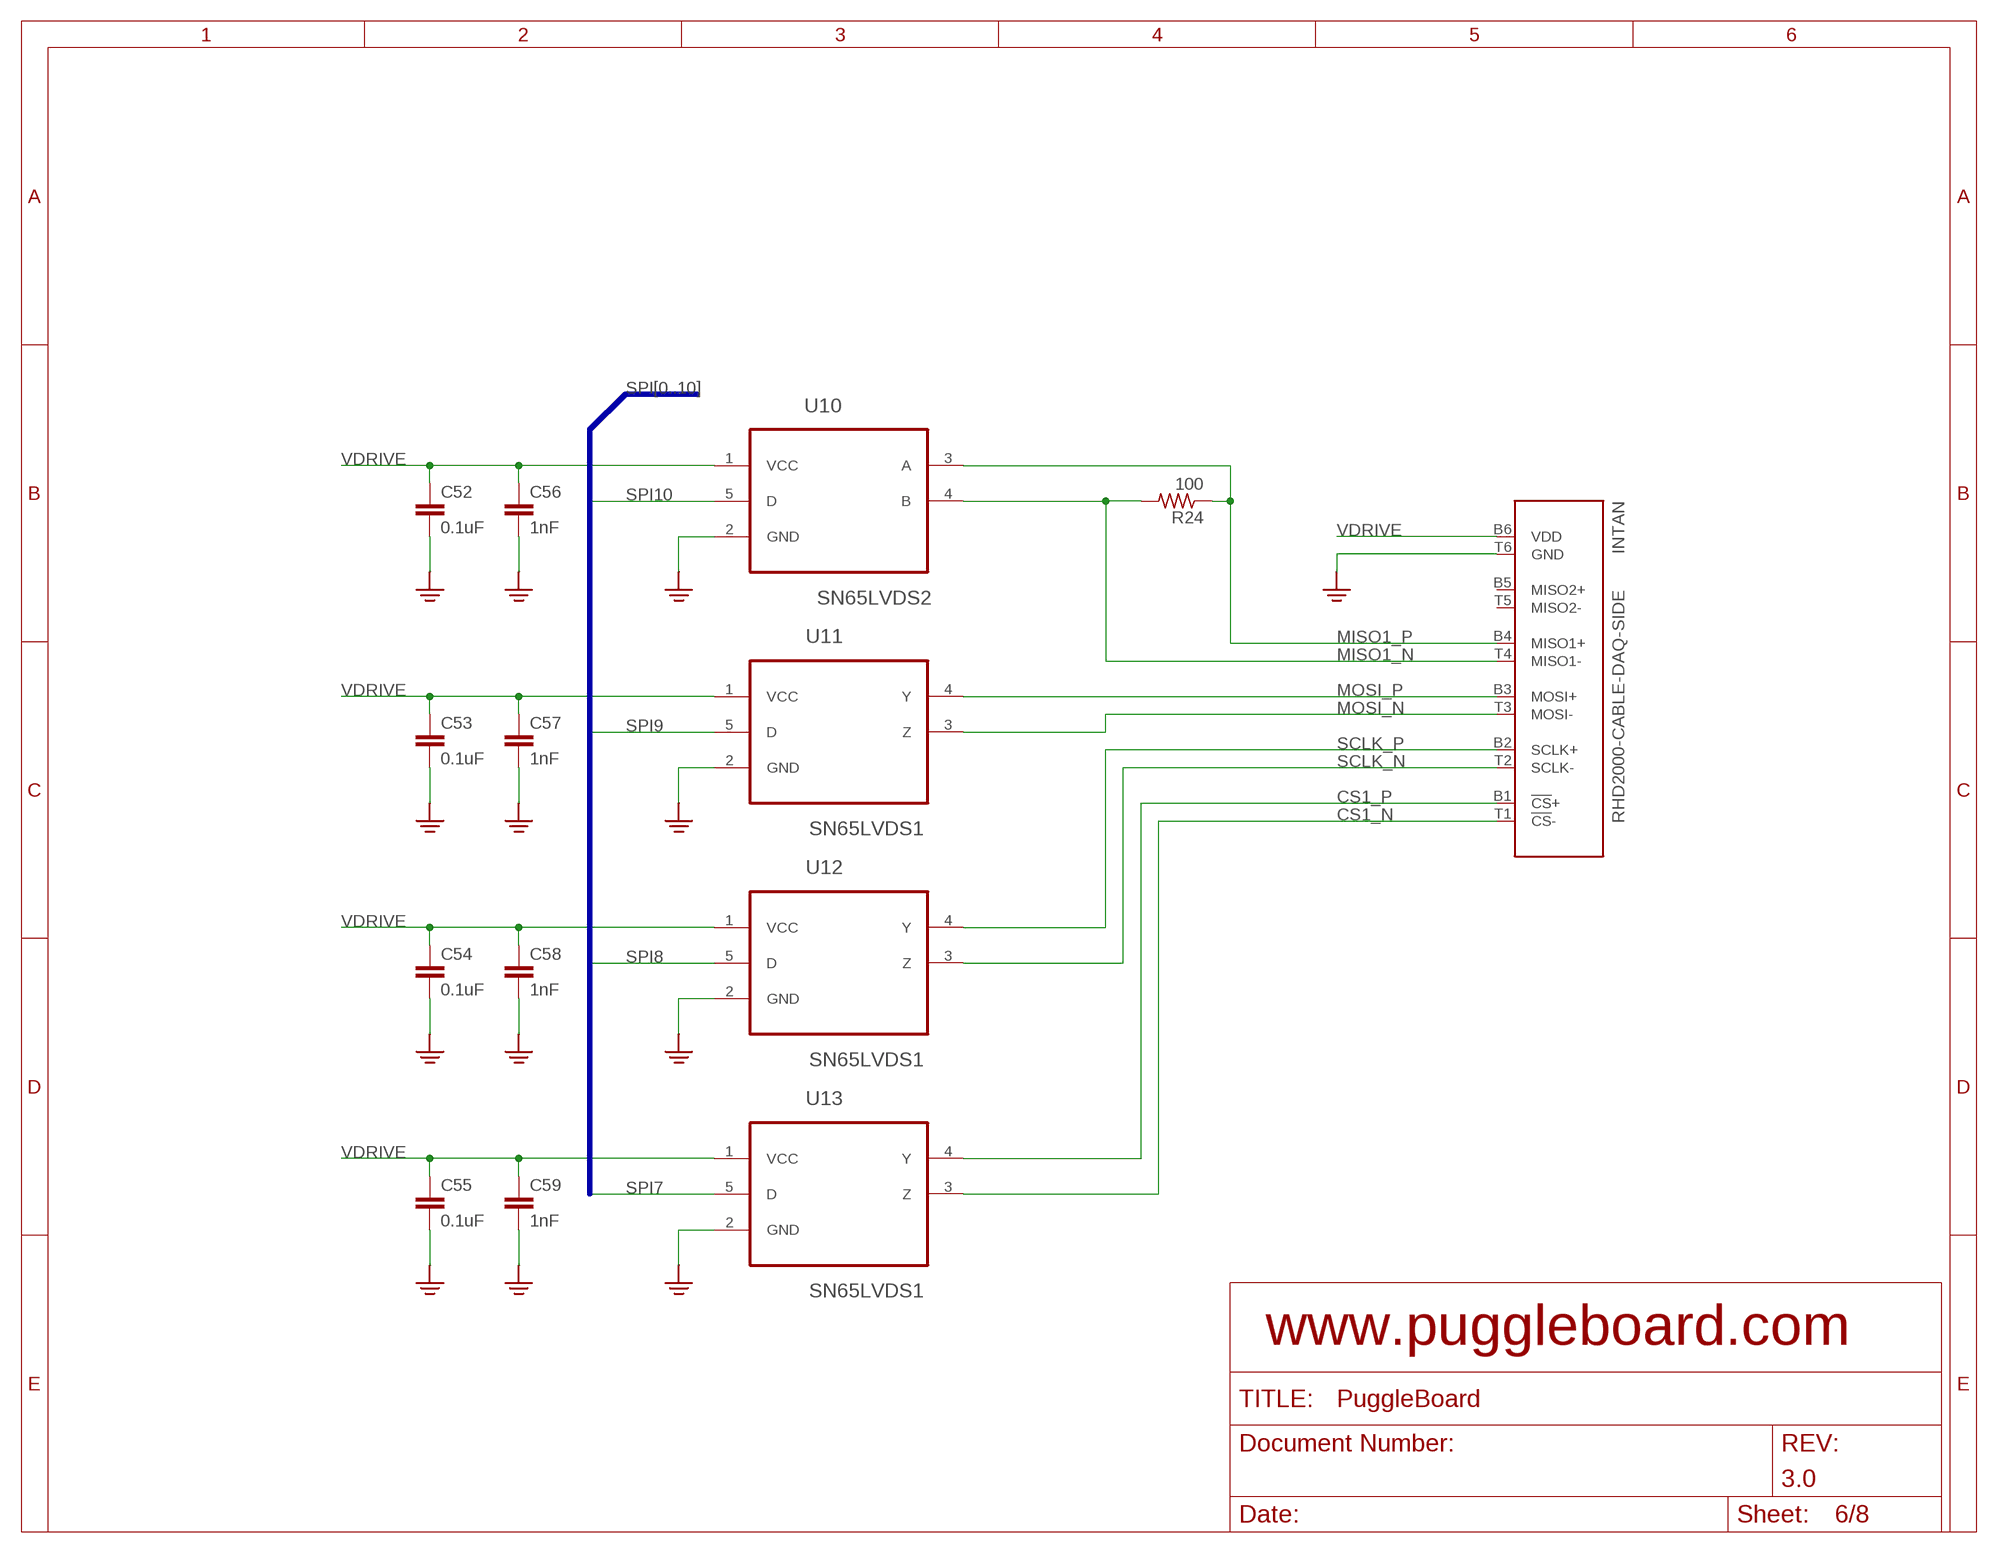
[diagram p5: schematic, sheet 6]

### Parts
C52  0.1uF  C_0603  [0603]
C53  0.1uF  C_0603  [0603]
C54  0.1uF  C_0603  [0603]
C55  0.1uF  C_0603  [0603]
C56  1nF  C_0603  [0603]
C57  1nF  C_0603  [0603]
C58  1nF  C_0603  [0603]
C59  1nF  C_0603  [0603]
INTAN  RHD2000-CABLE-DAQ-SIDE  [OMNETICS_PZN-12-AA]
R24  100  R_0603  [0603]
U10  SN65LVDS2  SN65LVDS2DBVR  [SOT95P280X145-5N]
U11  SN65LVDS1  SN65LVDS1DBVR  [SOT95P280X145-5N]
U12  SN65LVDS1  SN65LVDS1DBVR  [SOT95P280X145-5N]
U13  SN65LVDS1  SN65LVDS1DBVR  [SOT95P280X145-5N]

### Nets
CS1_N [diffpair]: INTAN.T1(!CS!-) U13.3(Z)
CS1_P [diffpair]: INTAN.B1(!CS!+) U13.4(Y)
GND: C52.2 C53.2 C54.2 C55.2 C56.2 C57.2 C58.2 C59.2 INTAN.T6(GND) U10.2(GND) U11.2(GND) U12.2(GND) U13.2(GND) ; also sheet 1,2,3,4,5,7,8
MISO1_N [diffpair]: INTAN.T4(MISO1-) R24.2 U10.4(B)
MISO1_P [diffpair]: INTAN.B4(MISO1+) R24.1 U10.3(A)
MOSI_N [diffpair]: INTAN.T3(MOSI-) U11.3(Z)
MOSI_P [diffpair]: INTAN.B3(MOSI+) U11.4(Y)
SCLK_N [diffpair]: INTAN.T2(SCLK-) U12.3(Z)
SCLK_P [diffpair]: INTAN.B2(SCLK+) U12.4(Y)
SPI7: U13.5(D) ; also sheet 1
SPI8: U12.5(D) ; also sheet 1
SPI9: U11.5(D) ; also sheet 1
SPI10: U10.5(D) ; also sheet 1
VDRIVE: C52.1 C53.1 C54.1 C55.1 C56.1 C57.1 C58.1 C59.1 INTAN.B6(VDD) U10.1(VCC) U11.1(VCC) U12.1(VCC) U13.1(VCC) ; also sheet 1,2,3,4,7,8
Unconnected: INTAN.B5(MISO2+) INTAN.T5(MISO2-)

### Buses
SPI[0..10]

## Sheet 7 of 8: SYNC
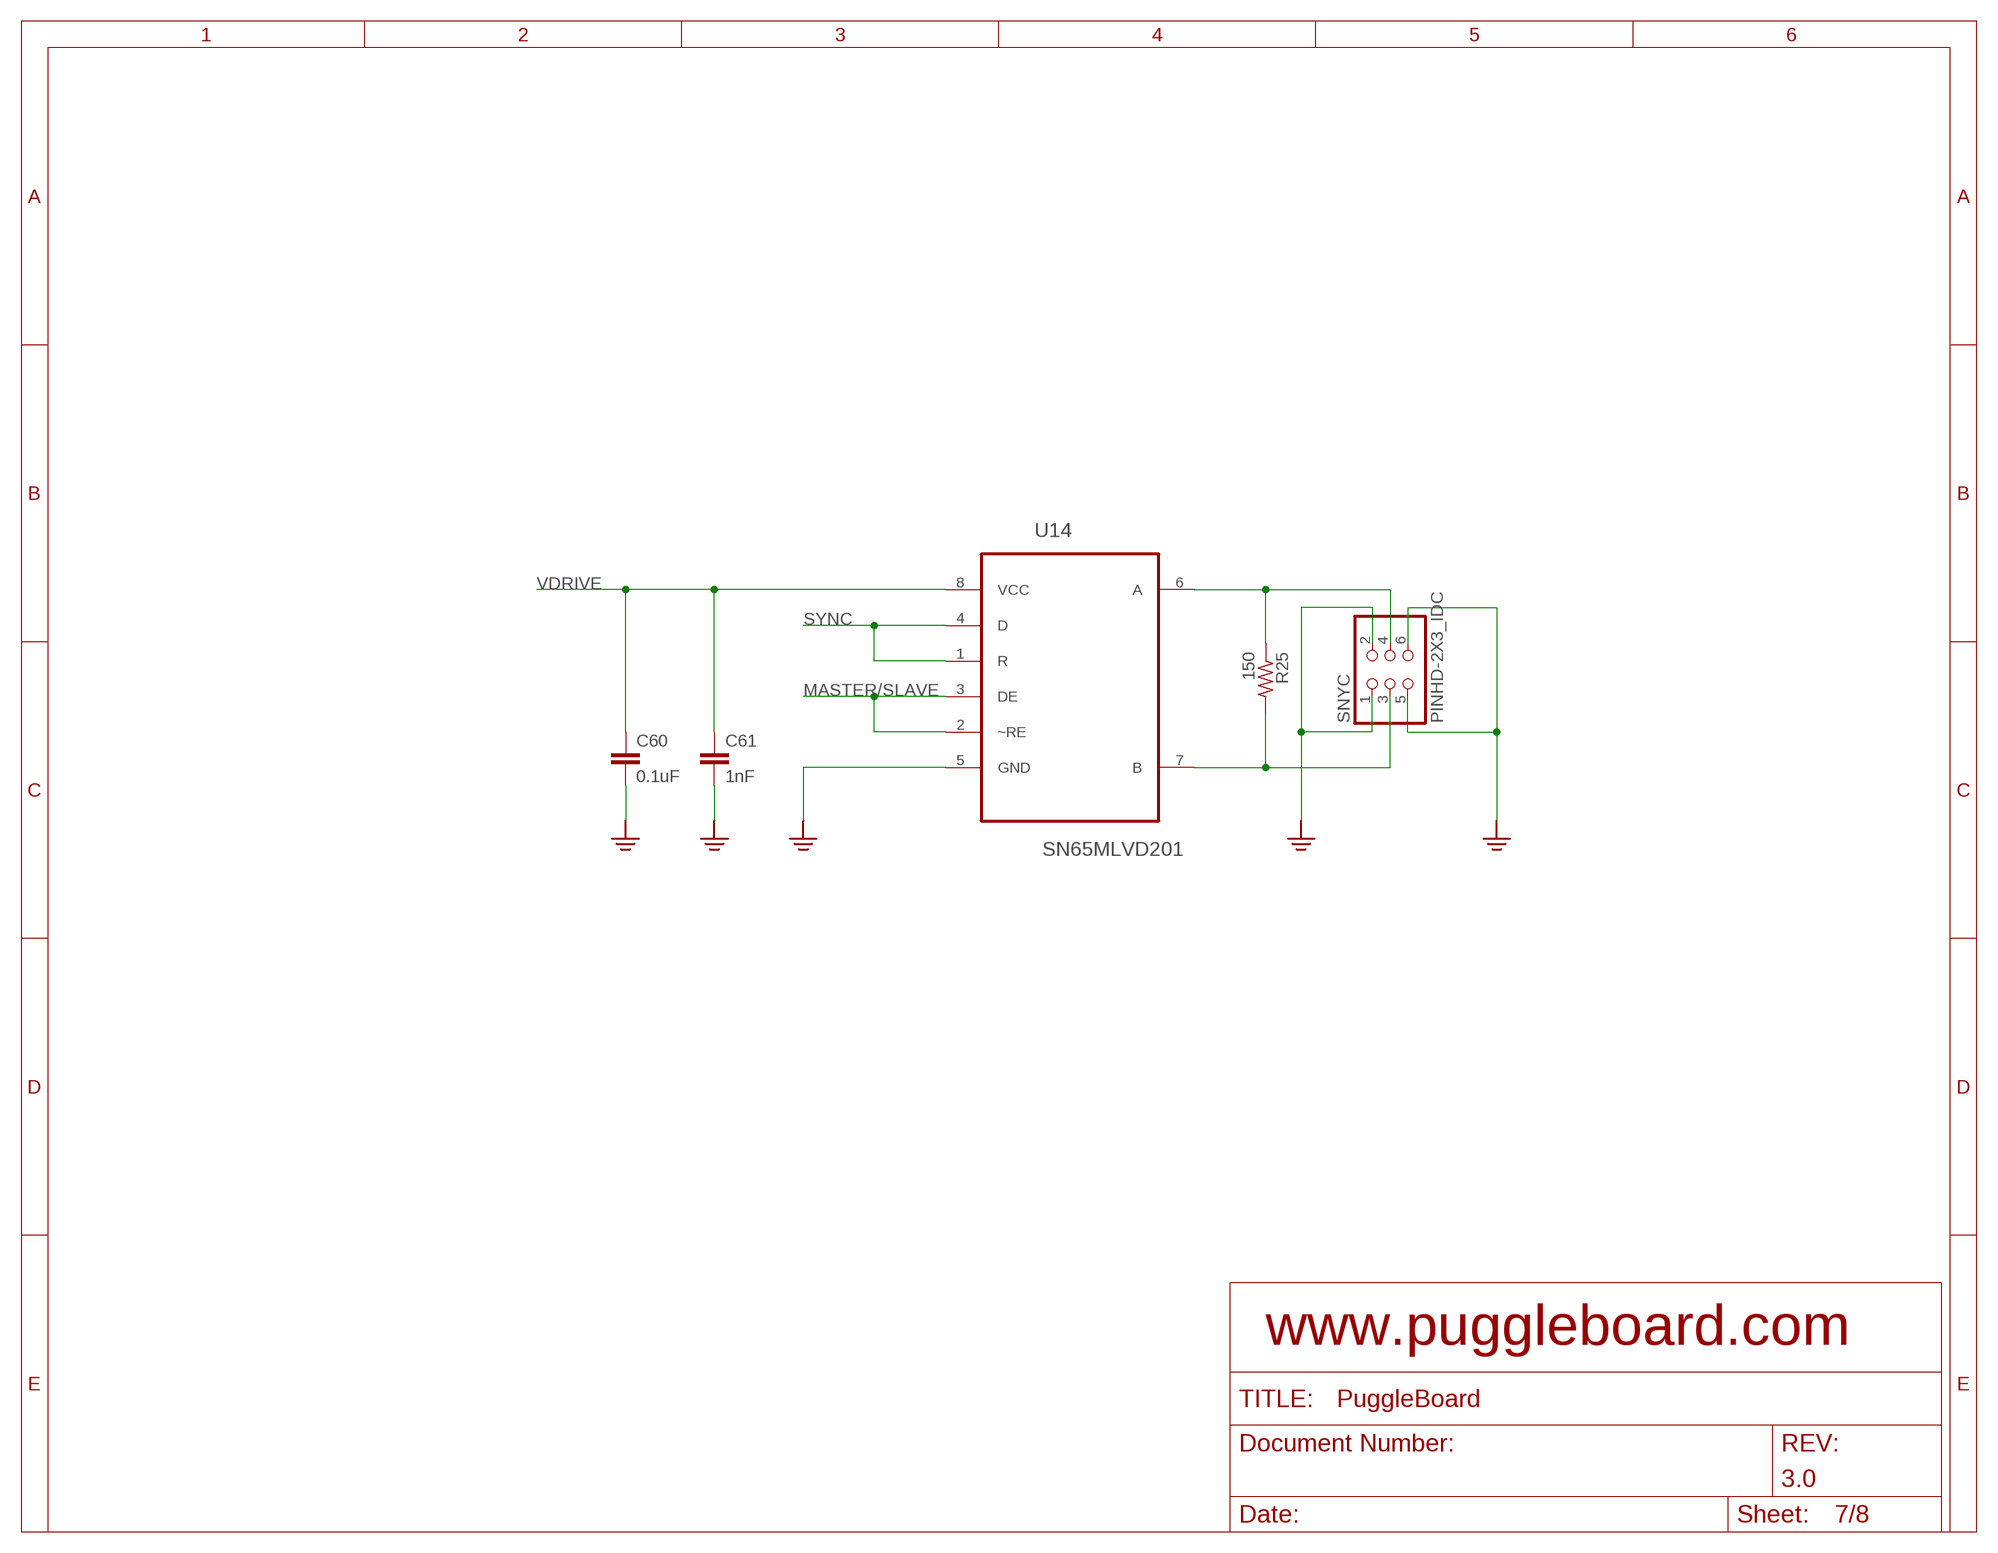
[diagram p6: schematic, sheet 7]

### Parts
C60  0.1uF  C_0603  [0603]
C61  1nF  C_0603  [0603]
R25  150  R_0603  [0603]
SNYC  PINHD-2X3_IDC  [2X03_IDC]
U14  SN65MLVD201  SN65MLVD201D  [SOIC127P600X175-8N]

### Nets
GND: C60.2 C61.2 SNYC.1 SNYC.2 SNYC.5 SNYC.6 U14.5(GND) ; also sheet 1,2,3,4,5,6,8
MASTER/SLAVE: U14.2(~RE) U14.3(DE) ; also sheet 1
SYNC: U14.1(R) U14.4(D) ; also sheet 1
SYNC_N [diffpair]: R25.2 SNYC.3 U14.7(B)
SYNC_P [diffpair]: R25.1 SNYC.4 U14.6(A)
VDRIVE: C60.1 C61.1 U14.8(VCC) ; also sheet 1,2,3,4,6,8

## Sheet 8 of 8: BOARD ID
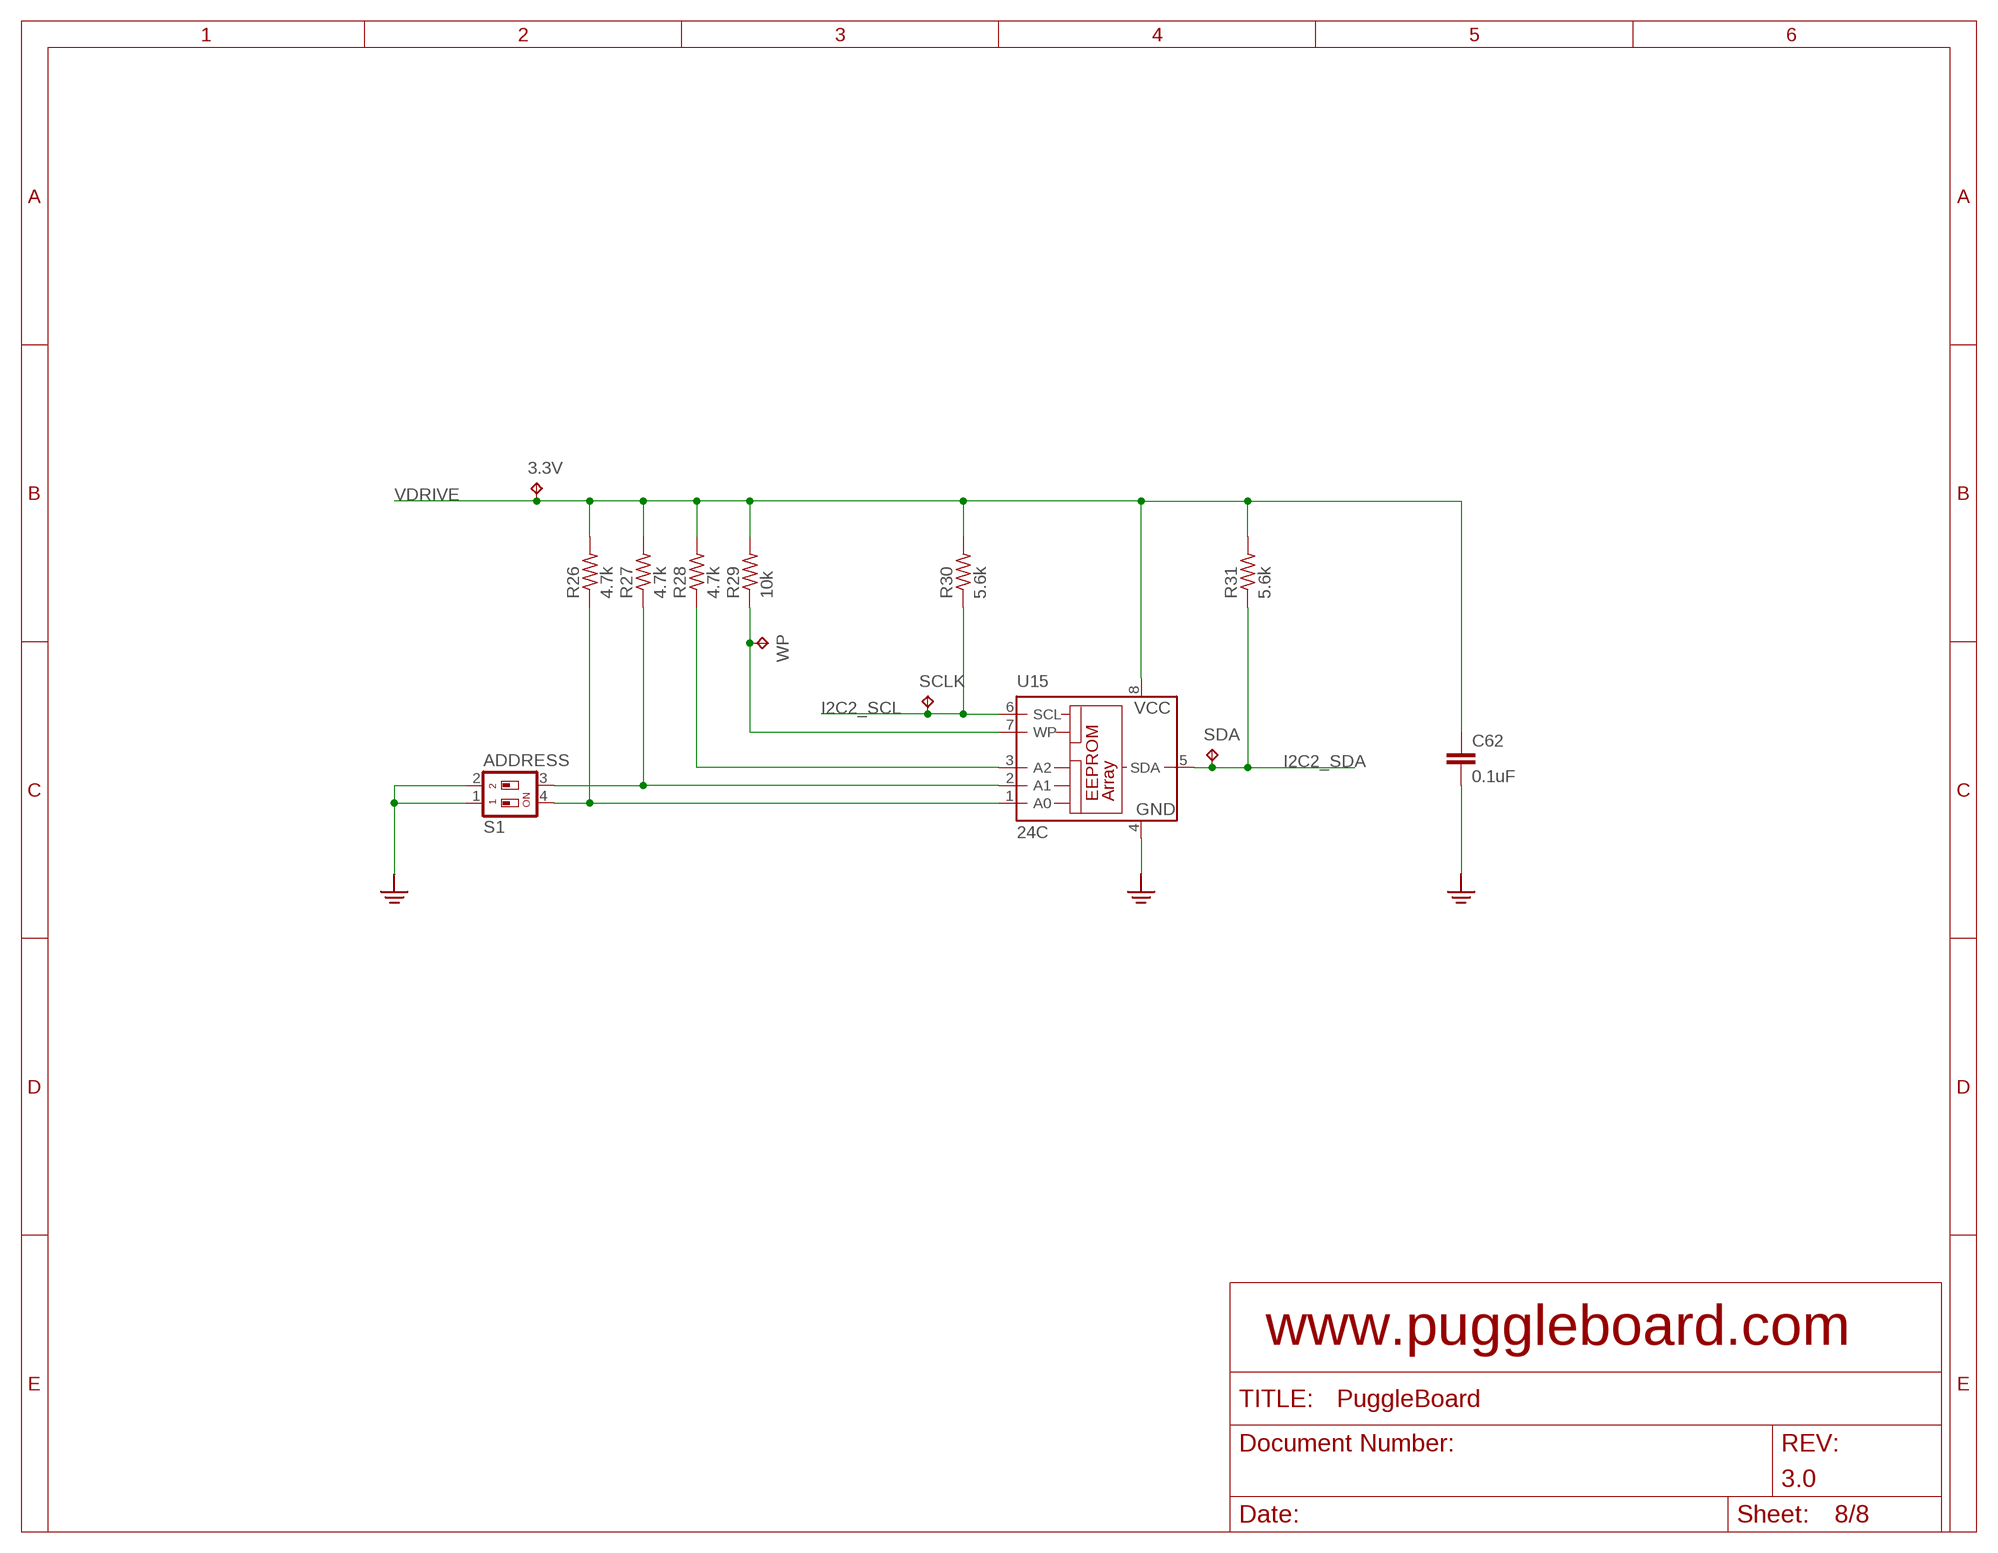
[diagram p7: schematic, sheet 8]

### Parts
3.3V  TPPAD1-17  [P1-17]
C62  0.1uF  C_0603  [0603]
R26  4.7k  R_0603  [0603]
R27  4.7k  R_0603  [0603]
R28  4.7k  R_0603  [0603]
R29  10k  R_0603  [0603]
R30  5.6k  R_0603  [0603]
R31  5.6k  R_0603  [0603]
S1  ADDRESS  SWS002  [SMS-002]
SCLK  TPB1,27  [B1,27]
SDA  TPB1,27  [B1,27]
U15  24C  [SO-08]
WP  TPTP14SQ  [TP14SQ]

### Nets
GND: C62.2 S1.1 S1.2 U15.4(GND) ; also sheet 1,2,3,4,5,6,7
I2C2_SCL: R30.1 SCLK.TP U15.6(SCL) ; also sheet 1
I2C2_SDA: R31.1 SDA.TP U15.5(SDA) ; also sheet 1
N$14: R26.1 S1.4 U15.1(A0)
N$18: R27.1 S1.3 U15.2(A1)
N$19: R28.1 U15.3(A2)
N$22: R29.1 U15.7(WP) WP.TP
VDRIVE: 3.3V.TP C62.1 R26.2 R27.2 R28.2 R29.2 R30.2 R31.2 U15.8(VCC) ; also sheet 1,2,3,4,6,7

## Power pins joined to a net without a drawn wire
BAT_SENSE: BB1.95(BAT_SENSE)
BL_IN: BB1.97(BL_IN)
BL_OUT: BB1.100(BL_OUT)
BL_SINK1: BB1.101(BL_SINK1)
BL_SINK2: BB1.102(BL_SINK2)

## Library data of the parts
3.3V +4.5V -4.5V AGND AIA+ AIB+ AIC+ AID+ AOA+ AOB+ AOC+ AOD+ DGND SCLK SDA VBIAS VREF VREF_PRE WP = testpad:TP: Test pad
A_I/O = puggleboard:PINHD-2X7
BB1 = puggleboard:BEAGLEBONE_OUTLINE: BeagleBone Pinout
C1-C12 C14-C19 C21-C42 C45-C62 = puggleboard:C: Capacitor
C13 = puggleboard:C: Capacitor; DK: 445-6797-1-ND; MN: TDK Corp.; PARTNO: C2012X5R1Cxxxxxxx; VID: DK
C20 = puggleboard:C: Capacitor; MN: TDK Corp.; PARTNO: C2012X5R1Cxxxxxxx; VID: DK
C43 C44 = puggleboard:C-POL: Polarized Capacitor
D1 = puggleboard:S-DIODE: Schottky Diode
INTAN = puggleboard:RHD2000-CABLE-DAQ-SIDE: Omnetics PZN-12-AA RHD2000 socket - DAQ side
L1 L2 L5 = puggleboard:L: Inductor
PWR = puggleboard:LED; DK: 350-2044-1-ND; MN: 598-8170-107F; MPN: Dialight
R1-R3 R6 R7 R9 = puggleboard:RX4
R4 R5 R8 R14-R20 R22-R31 = puggleboard:R: Resistor; DK: PxxxxHTR-ND; MN: Panasonic; MPN: ERJ-3EKFxxxxV
R10-R13 = puggleboard:R: Resistor
R21 = puggleboard:TRIM_US-: POTENTIOMETER
S1 = puggleboard:SWS002: SMD Dip Switch 2 pol.
SNYC = puggleboard:PINHD-2X3
U1 = puggleboard:LMP7704
U2 = puggleboard:ADS8331IBPW: ADC; MPN: ADS8331IBPW; OC_FARNELL: 1882255; OC_NEWARK: 27T6163; PACKAGE: TSSOP-24; SUPPLIER: Texas Instruments
U3 = puggleboard:OPA4209AIPW: OPERATIONAL AMPLIFIER
U4 = puggleboard:AD5686RARUZ: 16-bit DAC
U5 = puggleboard:LMR70503
U6 = puggleboard:TPS7A3001DGNR: ?36V, ?200mA, Ultralow-Noise, Negative LINEAR REGULATOR; MPN: TPS7A3001DGNR; OC_FARNELL: -; OC_NEWARK: 01T0878; PACKAGE: MSOP-8; SUPPLIER: Texas Instruments
U7 = puggleboard:TPS7A4901DGNR: ?36V, ?200mA, Ultralow-Noise, Negative LINEAR REGULATOR; MPN: TPS7A4901DGNR; OC_FARNELL: -; OC_NEWARK: 01T0879; PACKAGE: MSOP-8; SUPPLIER: Texas Instruments
U8 = puggleboard:REF5040MDREP: LOW-NOISE, VERY LOW DRIFT, PRECISION VOLTAGE REFERENCE
U9 = puggleboard:AD8032ARZ-REEL7: Rail-to-Rail I/O Amplifiers
U10 = puggleboard:SN65LVDS2DBVR: HIGH-SPEED DIFFERENTIAL LINE DRIVER/RECEIVERS; DIGIKEY: 296-6920-1-ND; MPN: SN65LVDS2DBVR; OC_FARNELL: 1652269; OC_NEWARK: 76C0744; PACKAGE: SOT-23-5; SUPPLIER: Texas Instruments
U11-U13 = puggleboard:SN65LVDS1DBVR: HIGH-SPEED DIFFERENTIAL LINE DRIVER/RECEIVERS; DIGIKEY: 296-6919-1-ND; MPN: SN65LVDS1DBVR; OC_FARNELL: -; OC_NEWARK: 76C0715; PACKAGE: SOT-23-5; SUPPLIER: Texas Instruments
U14 = puggleboard:SN65MLVD201D: MULTIPOINT-LVDS LINE DRIVER AND RECEIVER; MPN: SN65MLVD201D; OC_FARNELL: -; OC_NEWARK: 22H0109; PACKAGE: SOIC-8; SUPPLIER: Texas Instruments
U15 = puggleboard:24C*: Serial EEPROM 1 K/2 K/4 K

## Net classes
0 default: width 0.203 mm
1 supply: width 0.254 mm
2 diffpair: width 0.178 mm
3 gnd: width 0.254 mm

## Board
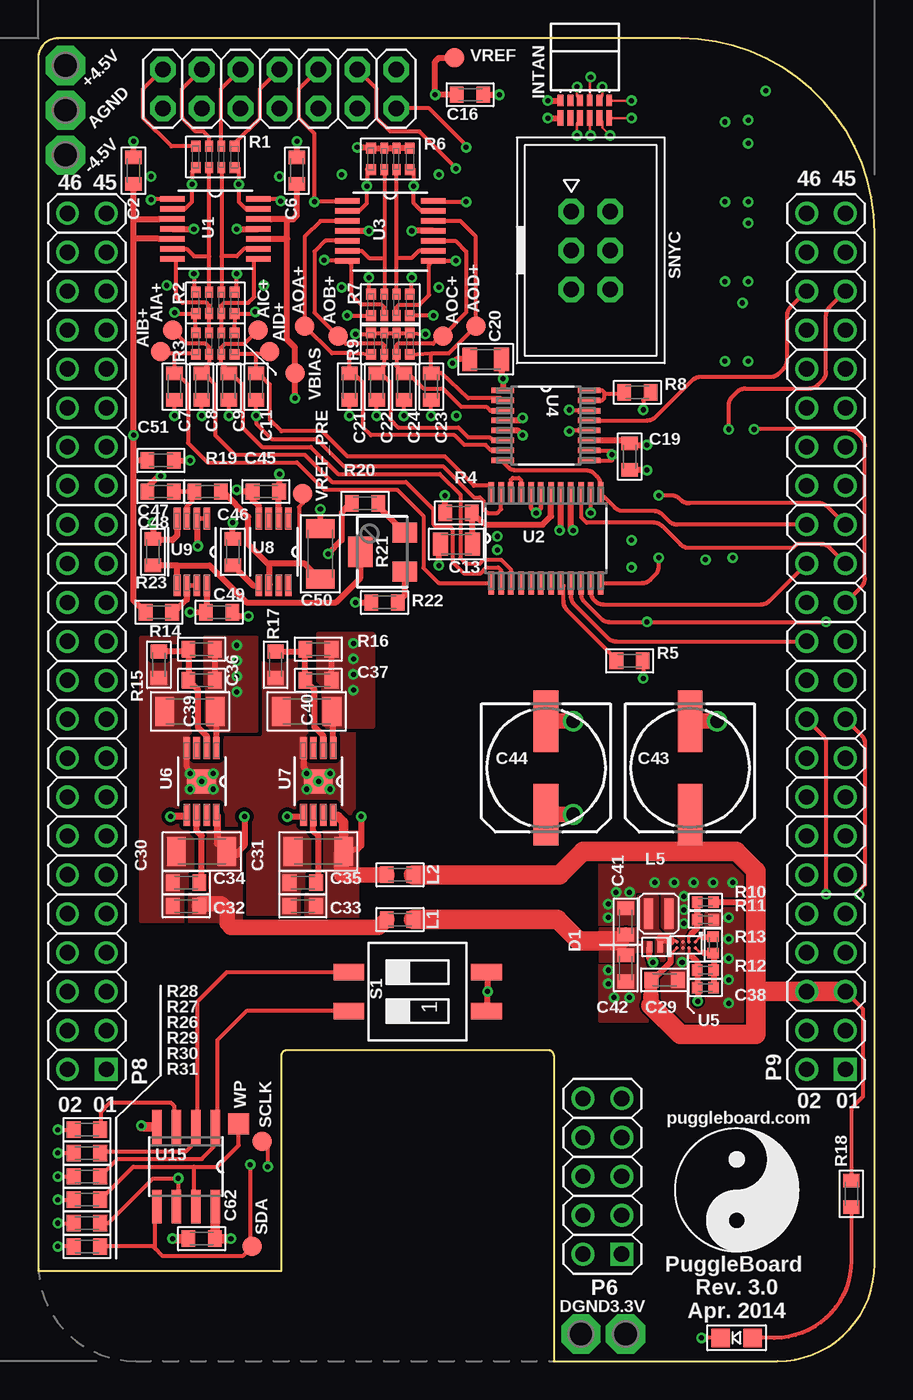
[diagram p8: board, top side]
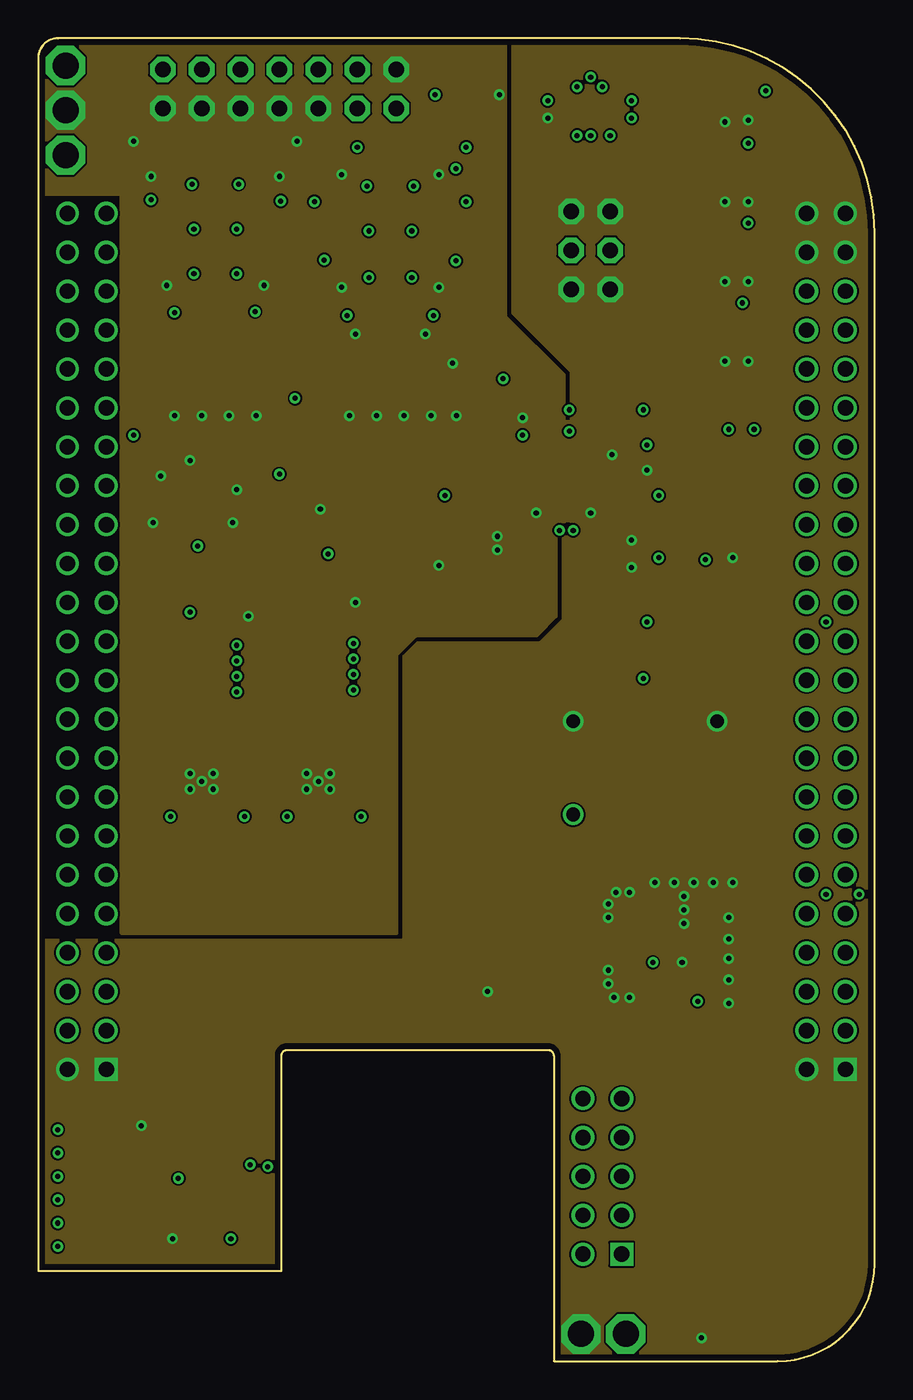
[diagram p9: board, inner layer GND]
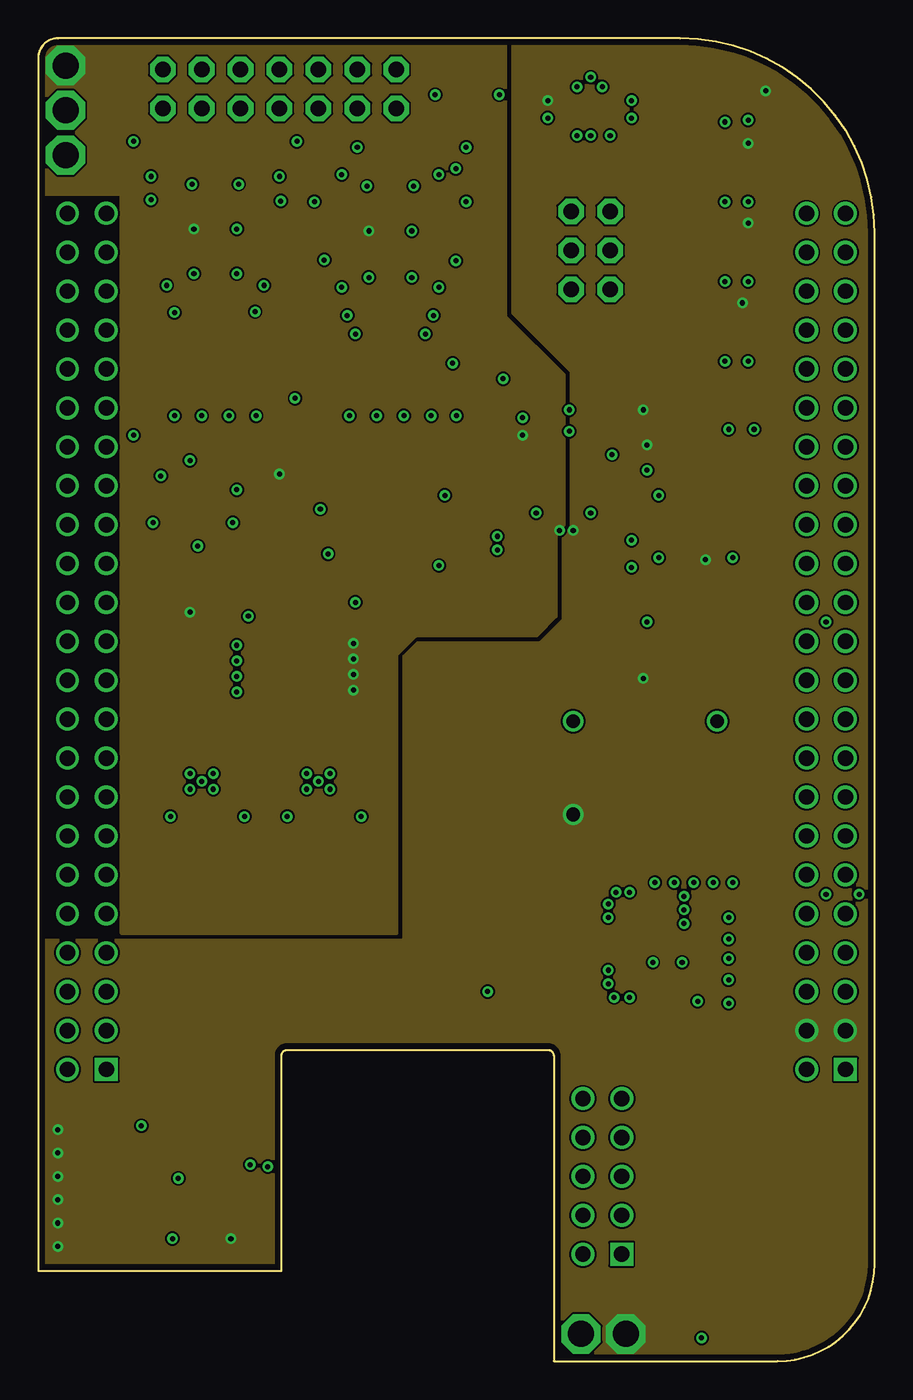
[diagram p10: board, inner layer PWR]
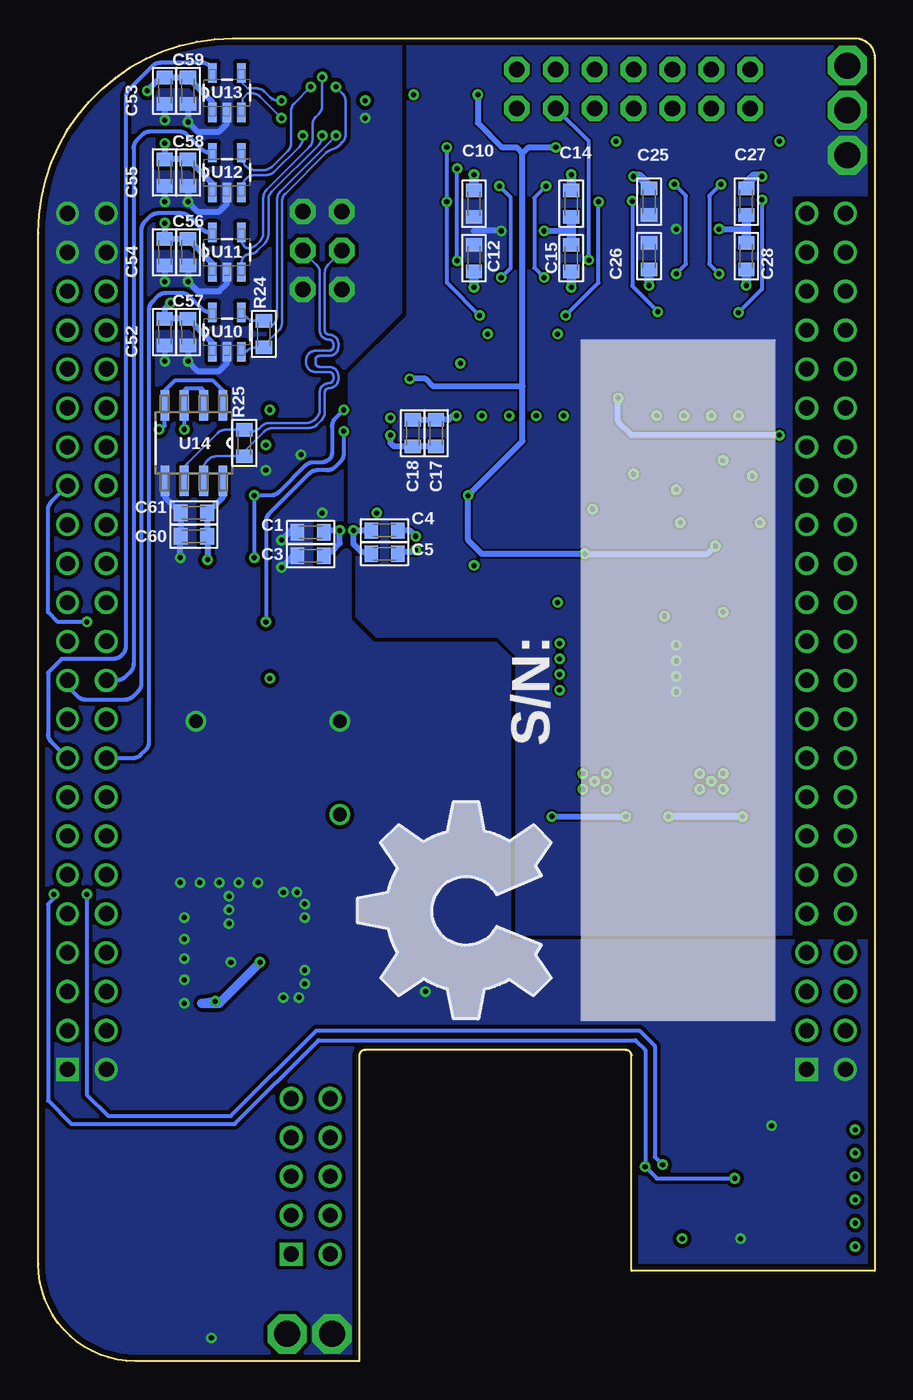
[diagram p11: board, bottom side, seen from below]

Size 54.61 x 86.36 mm. Coordinates in mm from the lower left corner, seen from the top.
Copper layers (1+2*15+16): Top 0.0356mm / dielectric 1.5011mm / GND 0.0356mm / dielectric 0.1499mm / PWR 0.0356mm / dielectric 0.2007mm / Bottom 0.0356mm
Design rules "ohs-park-4-layer": minimum track width 5mil, minimum drill 10mil, track to track 5mil, track to pad 5mil, pad to pad 5mil, via to via 5mil, smd to smd 5mil, copper to edge 15mil, drill to drill 5mil, minimum pad ring 7mil, minimum via ring 7mil, stop-mask expansion 4mil, vias tented up to drill 100mil, thermal gap 10mil

### Footprints (pad centres in the part's own frame; a part is rotated, then mirrored left to right if it is on the bottom)
P1-17 = drill 1.702 pad 2.54 octagon: TP 0,0
2X07 = drill 1.016 pad 1.676 octagon: 1 -7.62,-1.27; 2 -7.62,1.27; 3 -5.08,-1.27; 4 -5.08,1.27; 5 -2.54,-1.27; 6 -2.54,1.27; 7 0,-1.27; 8 0,1.27; 9 2.54,-1.27; 10 2.54,1.27; 11 5.08,-1.27; 12 5.08,1.27; 13 7.62,-1.27; 14 7.62,1.27
B1,27 = smd 1.27 x 1.27: TP 0,0
PUGGLEBOARD_SHIELD = drill 1 square: 1 4.445,19.05; 47 52.705,19.05; 93 38.1,6.985 | drill 1: 2 1.905,19.05; 3 4.445,21.59; 4 1.905,21.59; 5 4.445,24.13; 6 1.905,24.13; 7 4.445,26.67; 8 1.905,26.67; 9 4.445,29.21; 10 1.905,29.21; 11 4.445,31.75; 12 1.905,31.75; 13 4.445,34.29; 14 1.905,34.29; 15 4.445,36.83; 16 1.905,36.83; 17 4.445,39.37; 18 1.905,39.37; 19 4.445,41.91; 20 1.905,41.91; 21 4.445,44.45; 22 1.905,44.45; 23 4.445,46.99; 24 1.905,46.99; 25 4.445,49.53; 26 1.905,49.53; 27 4.445,52.07; 28 1.905,52.07; 29 4.445,54.61; 30 1.905,54.61; 31 4.445,57.15; 32 1.905,57.15; 33 4.445,59.69; 34 1.905,59.69; 35 4.445,62.23; 36 1.905,62.23; 37 4.445,64.77; 38 1.905,64.77; 39 4.445,67.31; 40 1.905,67.31; 41 4.445,69.85; 42 1.905,69.85; 43 4.445,72.39; 44 1.905,72.39; 45 4.445,74.93; 46 1.905,74.93; 48 50.165,19.05; 49 52.705,21.59; 50 50.165,21.59; 51 52.705,24.13; 52 50.165,24.13; 53 52.705,26.67; 54 50.165,26.67; 55 52.705,29.21; 56 50.165,29.21; 57 52.705,31.75; 58 50.165,31.75; 59 52.705,34.29; 60 50.165,34.29; 61 52.705,36.83; 62 50.165,36.83; 63 52.705,39.37; 64 50.165,39.37; 65 52.705,41.91; 66 50.165,41.91; 67 52.705,44.45; 68 50.165,44.45; 69 52.705,46.99; 70 50.165,46.99; 71 52.705,49.53; 72 50.165,49.53; 73 52.705,52.07; 74 50.165,52.07; 75 52.705,54.61; 76 50.165,54.61; 77 52.705,57.15; 78 50.165,57.15; 79 52.705,59.69; 80 50.165,59.69; 81 52.705,62.23; 82 50.165,62.23; 83 52.705,64.77; 84 50.165,64.77; 85 52.705,67.31; 86 50.165,67.31; 87 52.705,69.85; 88 50.165,69.85; 89 52.705,72.39; 90 50.165,72.39; 91 52.705,74.93; 92 50.165,74.93; 94 35.56,6.985; 95 38.1,9.525; 96 35.56,9.525; 97 38.1,12.065; 98 35.56,12.065; 99 38.1,14.605; 100 35.56,14.605; 101 38.1,17.145; 102 35.56,17.145
0603 = smd 0.889 x 1.067: 1 -0.864,0; 2 0.864,0
0805 = smd 0.965 x 1.524: 1 -1.041,0; 2 1.041,0
1206 = smd 1.219 x 1.88: 1 -1.651,0; 2 1.651,0
0402 = smd 0.686 x 0.762: 1 -0.533,0; 2 0.533,0
153CLV-0807 = smd 4 x 1.6: + 3.05,0; - -3.05,0
SOD882 = smd 0.4 x 0.7: A 0.35,0; C -0.35,0
OMNETICS_PZN-12-AA = smd 0.381 x 0.762: B1 1.587,-1.016; B2 0.953,-1.016; B3 0.318,-1.016; B4 -0.318,-1.016; B5 -0.953,-1.016; B6 -1.587,-1.016 | smd 0.381 x 1.016: T1 1.587,-2.159; T2 0.953,-2.159; T3 0.318,-2.159; T4 -0.318,-2.159; T5 -0.953,-2.159; T6 -1.587,-2.159
VLS2012E = smd 0.65 x 2: 1 -0.675,0; 2 0.675,0
CHIP-LED0805 = smd 1.2 x 1.2: A 0,-1.05; C 0,1.05
RX4_0612 = smd 0.64 x 0.7: P1 -1.27,-0.7; P2 -1.27,0.7; P7 1.27,-0.7; P8 1.27,0.7 | smd 0.5 x 0.7: P3 -0.4,-0.7; P4 -0.4,0.7; P5 0.4,-0.7; P6 0.4,0.7
SM-42/43W = smd 1.3 x 1.6: 1 -1.27,-1.45; 3 1.27,-1.45 | smd 2 x 1.6: 2 0,1.45
SMS-002 = smd 1.092 x 2.007: 1 -1.27,-4.496; 2 1.27,-4.496; 3 1.27,4.496; 4 -1.27,4.496
2X03_IDC = drill 1.016 pad 1.676 octagon: 1 -2.54,-1.27; 2 -2.54,1.27; 3 0,-1.27; 4 0,1.27; 5 2.54,-1.27; 6 2.54,1.27
SOP65P640X120-14N-MOD = smd 1.6 x 0.35: 1 -2.8,1.95; 2 -2.8,1.3; 3 -2.8,0.65; 4 -2.8,0; 5 -2.8,-0.65; 6 -2.8,-1.3; 7 -2.8,-1.95; 8 2.8,-1.95; 9 2.8,-1.3; 10 2.8,-0.65; 11 2.8,0; 12 2.8,0.65; 13 2.8,1.3; 14 2.8,1.95
SOP65P640X120-24N = smd 1.473 x 0.356: 1 -2.921,3.581; 2 -2.921,2.921; 3 -2.921,2.286; 4 -2.921,1.626; 5 -2.921,0.965; 6 -2.921,0.33; 7 -2.921,-0.33; 8 -2.921,-0.965; 9 -2.921,-1.626; 10 -2.921,-2.286; 11 -2.921,-2.921; 12 -2.921,-3.581; 13 2.921,-3.581; 14 2.921,-2.921; 15 2.921,-2.286; 16 2.921,-1.626; 17 2.921,-0.965; 18 2.921,-0.33; 19 2.921,0.33; 20 2.921,0.965; 21 2.921,1.626; 22 2.921,2.286; 23 2.921,2.921; 24 2.921,3.581
MO-153-AB = smd 1.473 x 0.356: 1 -2.819,2.286; 2 -2.819,1.626; 3 -2.819,0.965; 4 -2.819,0.33; 5 -2.819,-0.33; 6 -2.819,-0.965; 7 -2.819,-1.626; 8 -2.819,-2.286; 9 2.819,-2.286; 10 2.819,-1.626; 11 2.819,-0.965; 12 2.819,-0.33; 13 2.819,0.33; 14 2.819,0.965; 15 2.819,1.626; 16 2.819,2.286
8BGA = smd 0.24 x 0.24: A1 -0.6,-0.2; A2 -0.6,0.2; B1 -0.2,-0.2; B2 -0.2,0.2; C1 0.2,-0.2; C2 0.2,0.2; D1 0.6,-0.2; D2 0.6,0.2
SOP65P490X110-9N = smd 1.422 x 0.432: 1 -2.184,0.965; 2 -2.184,0.33; 3 -2.184,-0.33; 4 -2.184,-0.965; 5 2.184,-0.965; 6 2.184,-0.33; 7 2.184,0.33; 8 2.184,0.965 | smd 1.575 x 1.88: 9 0,0
SOP65P490X110-8N = smd 1.422 x 0.432: 1 -2.184,0.965; 2 -2.184,0.33; 3 -2.184,-0.33; 4 -2.184,-0.965; 5 2.184,-0.965; 6 2.184,-0.33; 7 2.184,0.33; 8 2.184,0.965
SOT95P280X145-5N = smd 1.27 x 0.559: 1 -1.295,0.94; 2 -1.295,0; 3 -1.295,-0.94; 4 1.295,-0.94; 5 1.295,0.94
SOIC127P600X175-8N = smd 1.981 x 0.559: 1 -2.464,1.905; 2 -2.464,0.635; 3 -2.464,-0.635; 4 -2.464,-1.905; 5 2.464,-1.905; 6 2.464,-0.635; 7 2.464,0.635; 8 2.464,1.905
SO-08 = smd 0.6 x 2.2: 1 -1.905,-2.6; 2 -0.635,-2.6; 3 0.635,-2.6; 4 1.905,-2.6; 5 1.905,2.6; 6 0.635,2.6; 7 -0.635,2.6; 8 -1.905,2.6
TP14SQ = smd 1.4 x 1.4: TP 0,0

### Placement (x,y rotation side)
3.3V  38.35,1.78 0 top
+4.5V  1.78,84.58 0 top
-4.5V  1.78,78.74 0 top
A_I/O  15.75,83.06 0 top
AGND  1.78,81.66 0 top
AIA+  8,65.91 0 top
AIB+  8.76,67.31 0 top
AIC+  14.35,67.31 0 top
AID+  15.11,65.91 0 top
AOA+  17.4,67.56 0 top
AOB+  19.56,66.93 0 top
AOC+  26.42,66.93 0 top
AOD+  28.57,67.56 0 top
BB1  0,0 0 top
C1  36.83,54.1 180 bottom
C2  6.22,77.72 90 top
C3  36.83,52.58 180 bottom
C4  32,54.23 180 bottom
C5  32,52.7 180 bottom
C6  16.89,77.72 90 top
C7  8.89,63.63 90 top
C8  10.67,63.63 90 top
C9  12.45,63.63 90 top
C10  26.16,75.56 90 bottom
C11  14.22,63.63 90 top
C12  26.16,72.01 270 bottom
C13  27.3,53.34 0 top
C14  19.81,75.56 90 bottom
C15  19.81,72.01 270 bottom
C16  28.19,82.68 0 top
C17  28.64,60.58 90 bottom
C18  30.16,60.58 90 bottom
C19  38.61,59.05 270 top
C20  29.21,65.41 180 top
C21  20.32,63.63 270 top
C22  22.1,63.63 270 top
C23  25.65,63.63 270 top
C24  23.88,63.63 270 top
C25  14.73,75.69 90 bottom
C26  14.73,72.14 270 bottom
C27  8.38,75.69 90 bottom
C28  8.38,72.14 270 bottom
C29  40.89,24.89 0 top
C30  10.67,33.27 180 top
C31  18.29,33.27 180 top
C32  9.65,29.72 180 top
C33  17.27,29.72 180 top
C34  9.65,31.24 180 top
C35  17.27,31.24 180 top
C36  10.67,44.45 180 top
C37  18.29,44.45 180 top
C38  43.56,24.38 0 top
C39  9.91,42.42 180 top
C40  17.53,42.42 180 top
C41  38.35,28.7 270 top
C42  38.35,25.65 90 top
C43  42.55,38.73 270 top
C44  33.15,38.73 270 top
C45  14.86,56.77 0 top
C46  12.7,52.83 270 top
C47  8,56.77 180 top
C48  7.49,52.83 90 top
C49  11.81,48.9 0 top
C50  18.41,52.7 90 top
C51  8,58.8 0 top
C52  46.35,67.18 270 bottom
C53  46.35,82.93 270 bottom
C54  46.35,72.39 270 bottom
C55  46.35,77.6 270 bottom
C56  44.83,72.39 270 bottom
C57  44.83,67.18 270 bottom
C58  44.83,77.6 270 bottom
C59  44.83,82.93 270 bottom
C60  44.45,53.85 180 bottom
C61  44.45,55.37 180 bottom
C62  10.67,8 180 top
D1  40.26,27.05 180 top
DGND  35.43,1.78 0 top
INTAN  35.69,83.31 0 top
L1  23.62,28.83 180 top
L2  23.62,31.75 180 top
L5  40.51,29.21 0 top
PWR  45.59,1.52 90 top
R1  11.56,78.61 0 top
R2  11.56,69.09 0 top
R3  11.56,66.42 0 top
R4  27.43,55.37 180 top
R5  38.61,45.72 0 top
R6  22.99,78.49 0 top
R7  22.99,68.96 0 top
R8  39.12,63.25 0 top
R9  22.99,66.42 180 top
R10  43.56,29.97 180 top
R11  43.56,28.83 0 top
R12  43.56,25.53 0 top
R13  44.07,27.18 90 top
R14  10.67,46.48 180 top
R15  7.87,45.47 270 top
R16  18.29,46.48 180 top
R17  15.49,45.47 270 top
R18  53.09,10.92 90 top
R19  11.05,56.77 0 top
R20  21.34,56.01 0 top
R21  22.48,52.83 90 top
R22  22.61,49.53 180 top
R23  7.87,48.9 0 top
R24  39.88,67.06 90 bottom
R25  41.15,59.94 270 bottom
R26  3.17,12.06 180 top
R27  3.17,13.59 180 top
R28  3.17,15.11 180 top
R29  3.17,10.54 180 top
R30  3.17,9.02 180 top
R31  3.17,7.49 180 top
S1  24.77,24.13 90 top
SCLK  14.61,14.35 90 top
SDA  13.97,7.49 90 top
SNYC  36.07,72.52 270 top
U1  11.56,73.91 0 top
U2  33.15,53.72 90 top
U3  22.99,73.79 0 top
U4  33.15,61.09 0 top
U5  42.29,27.18 180 top
U6  10.67,37.85 270 top
U7  18.29,37.85 270 top
U8  15.37,52.83 270 top
U9  10.03,52.83 270 top
U10  42.29,67.18 90 bottom
U11  42.29,72.39 90 bottom
U12  42.29,77.6 90 bottom
U13  42.29,82.8 90 bottom
U14  44.45,59.94 270 bottom
U15  9.65,12.7 180 top
U$1  [PB-LOGO-NOSITE]  41.27,7.11 0 top
U$2  [OSHW_FILLX500_NOTEXT]  21.08,22.35 90 bottom
VBIAS  16.76,64.52 0 top
VREF  27.18,85.09 0 top
VREF_PRE  17.27,56.64 0 top
WP  13.08,15.49 180 top

### Tracks (layer width: path | path; a pad name or v marks a point on that pad's centre or on a via)
+4.5V  (via drill 0.33)
  Top 0.406: U3.4 v21.59,73.79 | U8.2 15.7,56.74 C45.2 15.72,56.74 15.75,56.77 v15.75,57.91 | U1.4 v10.16,73.91 | v9.91,48.9 C49.1 11,48.95 U9.8 | v31.62,60.45 31.32,60.76 U4.5 | v34.04,54.23 34.11,54.36 U2.17 | C37.1 R16.1 19.18,46.51 | U7.1 19.25,42.34 C40.1
  Bottom 0.406: v21.59,73.79 19.81,73.79 | v10.16,73.91 8.38,73.91 | C17.1 C18.1 31.39,59.72 31.62,59.94 v31.62,60.45 | C5.2 33.51,52.83 34.04,53.36 v34.04,54.23 C4.2
  Bottom 0.61: 8.38,74.93 C27.1 8.38,73.91 C28.1 | C14.1 19.81,73.79 C15.1
  other vias: 20.57,46.86 20.57,45.85 20.57,44.83 20.57,43.81
  pour Top (isolate 0.254, no thermals): 21.84,41.4 18.29,41.4 18.29,47.5 21.84,47.5
  pour PWR (rank 2, no thermals): 0,86.36 30.48,86.49 30.48,68.2 34.29,64.39 34.29,54.61 33.78,54.1 33.78,48.64 32.51,47.37 24.64,47.37 23.37,46.1 23.37,27.94 5.46,27.94 5.46,76.2 0,76.2
-4.5V  (via drill 0.33)
  Top 0.406: U3.11 v24.38,73.79 | v12.95,73.91 U1.11 | C36.1 R14.1 11.56,46.51 | U6.1 11.63,42.34 C39.1
  Bottom 0.406: v24.38,73.79 26.16,73.79
  other vias: 12.95,44.7 12.95,45.72 12.95,46.74 12.95,43.69
  pour Bottom (rank 2, no thermals): 0,86.36 30.48,86.49 30.48,68.2 34.29,64.39 34.29,54.61 33.78,54.1 33.78,48.64 32.51,47.37 24.64,47.37 23.37,46.1 23.37,27.94 5.46,27.94 5.46,76.2 0,76.2
  pour Top (isolate 0.254, no thermals): 10.92,47.24 14.22,47.24 14.22,41.15 10.92,41.15
ADC_-IN_A  (via drill 0.33)
  Top 0.254: R1.P1 10.03,77.66 v10.03,76.83 10.03,75.69 9.55,75.21 U1.2 | 10.1,69.79 R2.P2 10.16,70.04 v10.16,70.99
  Bottom 0.254: v10.03,76.83 10.79,76.07 10.79,71.63 v10.16,70.99
ADC_-IN_B
  Top 0.254: R2.P4 11.16,72.14 | 11.16,72.14 R1.P3 | U1.6 9.68,72.61 10.16,72.14 11.16,72.14
ADC_-IN_C
  Top 0.254: R1.P5 11.96,72.14 | 11.96,72.14 R2.P6 | U1.9 13.43,72.61 12.95,72.14 11.96,72.14
ADC_-IN_D  (via drill 0.33)
  Top 0.254: R1.P7 13.02,77.91 13.08,77.85 v13.08,76.83 13.08,75.69 13.59,75.18 14.33,75.18 U1.13 | R2.P8 12.83,69.85 12.95,69.98 v12.95,70.99
  Bottom 0.254: v12.95,70.99 12.32,71.63 12.32,76.07 v13.08,76.83
ADC_A
  Top 0.254: R1.P2 8.7,79.31 6.86,81.15 6.86,83.06 A_I/O.2
ADC_A+  (via drill 0.33)
  Top 0.254: R3.P2 10.26,68.36 R2.P1 8.96,68.39 v8.89,68.45 | U1.1 7.41,75.86 arc90 v7.37,75.82
  Bottom 0.254: v7.37,75.82 7.37,69.98 v8.89,68.45
ADC_B
  Top 0.254: A_I/O.4 9.4,83.06 9.4,81.15 10.29,80.26 10.79,80.26 11.16,79.9 R1.P4
ADC_B+
  Top 0.254: U1.7 9.02,71.96 9.02,69.47 9.4,69.09 10.99,69.09 11.16,68.92 R2.P3 R3.P4
ADC_C
  Top 0.254: 11.94,79.33 11.94,83.06 A_I/O.6
  Top 0.305: R1.P6 11.94,79.33
ADC_C+
  Top 0.254: U1.8 14.1,71.96 14.1,69.47 13.72,69.09 12.12,69.09 11.96,68.92 R2.P5 R3.P6
ADC_D
  Top 0.254: A_I/O.8 14.48,83.06 14.48,81.15 12.83,79.5 R1.P8
ADC_D+  (via drill 0.33)
  Top 0.254: R3.P8 12.86,68.36 R2.P7 14.03,68.39 v14.16,68.52 | v15.83,75.74 15.7,75.86 U1.14
  Bottom 0.254: v14.16,68.52 15.83,70.19 v15.83,75.74
AGND1
  Top 0.406: U7.2 18.62,40.82 18.03,41.4 18.03,43.85 C37.2 R16.2 17.02,46.32 R17.1
AGND2
  Top 0.406: R15.1 9.65,46.32 R14.2 C36.2 10.41,43.85 10.41,41.4 11,40.82 U6.2
CS1_N  (via drill 0.33)
  Top 0.178: INTAN.T1 v38.73,81.15
  Bottom 0.178: U13.3 41.27,81.58 41.27,82.42 40.93,82.77 40.66,82.77 arc45 40.12,82.54 v38.73,81.15
CS1_P  (via drill 0.33)
  Top 0.178: INTAN.B1 v38.73,82.3
  Bottom 0.178: v38.73,82.3 38.95,82.3 arc45 39.49,82.52 39.84,82.87 arc-45 40.38,83.1 40.93,83.1 41.27,83.44 41.27,84.02 U13.4
DAC_+IN_A
  Top 0.254: U3.3 18.41,74.44 17.4,73.42 AOA+.TP 19.17,65.8 20.32,65.8 | C21.1 20.6,64.49 | 20.6,64.49 21.21,63.88 21.21,60.96 21.72,60.45 27.18,60.45 27.81,59.82 29.21,59.82 29.57,59.46 U4.7 | R9.P8 20.32,65.8 | 20.6,64.49 20.32,64.64 20.32,65.8
DAC_+IN_B
  Top 0.254: U3.5 18.74,73.14 18.03,72.43 18.03,68.45 AOB+.TP 20.07,66.42 22.48,66.42 22.59,66.31 R9.P6 22.59,64.98 C22.1 22.38,64.49 22.99,63.88 22.99,61.47 23.5,60.96 27.43,60.96 28.07,60.33 29.46,60.33 29.59,60.2 30.25,60.2 U4.6
DAC_+IN_C
  Top 0.254: U3.10 27.23,73.14 27.94,72.43 27.94,68.45 AOC+.TP 26.29,66.93 25.78,66.42 23.5,66.42 23.37,66.29 23.37,65.81 R9.P4 23.39,64.98 C24.1 24.16,64.49 25.15,63.5 26.42,63.5 27.61,62.31 29.26,62.31 29.52,62.05 U4.3
DAC_+IN_D
  Top 0.254: U3.12 27.56,74.44 28.57,73.42 AOD+.TP 26.81,65.8 25.65,65.8 | R9.P2 25.65,65.8 | 25.93,64.49 C23.1 | C23.1 25.65,65.8 | U4.2 30.3,62.74 30.23,62.87 28.07,62.87 26.31,64.49 C23.1
DAC_-IN_A  (via drill 0.33)
  Top 0.254: R7.P2 21.59,69.66 v21.59,70.74 | R6.P1 21.46,77.79 v21.46,76.71 21.46,75.6 20.92,75.06 20.22,75.06 arc-90 U3.2
  Bottom 0.254: v21.46,76.71 22.23,75.95 22.23,71.37 v21.59,70.74
DAC_-IN_B
  Top 0.254: R7.P4 22.61,69.66 22.61,72.01 | R6.P3 22.61,77.79 22.61,72.01 | U3.6 21.11,72.49 21.59,72.01 22.61,72.01
DAC_-IN_C
  Top 0.254: 25.79,72.52 U3.9 24.86,72.49 24.38,72.01 23.37,72.01 | R7.P6 23.37,69.66 23.37,72.01 | R6.P5 23.37,77.79 23.37,72.01
DAC_-IN_D  (via drill 0.33)
  Top 0.254: R7.P8 24.38,69.66 v24.38,70.74 | R6.P7 24.51,77.79 v24.51,76.71 24.51,75.61 25.03,75.09 U3.13
  Bottom 0.254: v24.38,70.74 23.75,71.37 23.75,75.95 v24.51,76.71
DAC_A  (via drill 0.33)
  Top 0.254: U3.8 | R7.P5 23.39,68.79 23.55,68.96 24.89,68.96 25.53,69.6 25.53,71.58 U3.8 | U3.8 v27.26,71.84 | v27.26,77.85 27.26,77.9 24.89,80.26 22.99,80.26 22.1,81.15 22.1,83.06 A_I/O.12
  Bottom 0.254: v27.26,71.84 v27.26,77.85
DAC_B  (via drill 0.33)
  Top 0.254: v25.8,68.26 R7.P7 | v27.94,75.69 25.83,75.69 U3.14 | v27.94,79.25 27.94,79.38 25.53,81.79 A_I/O.13
  Bottom 0.254: v27.94,79.25 v27.94,75.69 27.94,70.4 v25.8,68.26
DAC_C  (via drill 0.33)
  Top 0.254: U3.7 20.45,71.84 | R7.P3 22.59,68.79 22.42,68.96 21.08,68.96 20.45,69.6 20.45,71.58 U3.7 | U3.7 18.67,71.84 v18.67,71.88
  Bottom 0.254: v18.67,71.88 18.67,79.63 A_I/O.11
DAC_D  (via drill 0.33)
  Top 0.254: v20.18,68.26 R7.P1 | U3.1 20.14,75.69 v18.03,75.69 18.03,80.14 17.02,81.15 17.02,83.06 A_I/O.10
  Bottom 0.254: v20.18,68.26 18.03,70.4 v18.03,75.69
GND  (via drill 0.33, 0.9)
  Top 0.254: PWR.C v43.31,1.52 | R9.P7 R9.P5 R9.P3 R9.P1 25.26,67.05 v25.27,67.06 | v20.7,67.06 21.72,67.06 | v20.32,61.72 C21.2 | v22.1,61.72 C22.2 | v23.88,61.72 C24.2 | v25.65,61.72 C23.2 | v8.89,61.72 C7.1 | v10.67,61.72 C8.1 | v12.45,61.72 C9.1 | C11.1 v14.22,61.72 14.22,61.21 15.24,60.2 18.16,60.2 19.94,58.42 26.42,58.42 28.45,56.39 28.83,56.39 29.08,56.13 29.08,55.63 29.34,55.37 29.97,55.37 30.23,55.63 U2.23 | U4.10 36.07,59.44 37.47,59.44 v37.47,59.18 37.47,58.8 U4.9 | v36.07,55.37 U2.14
  Top 0.305: U2.19 32.82,55.68 v32.51,55.37 32.18,55.7 U2.20
  Top 0.406: U7.4 17.32,38.81 v17.53,38.35 U7.9 | U6.9 v9.91,38.35 9.7,38.81 U6.4 | C49.2 12.68,48.67 12.7,48.64 v13.72,48.64 | U9.4 9.07,53.9 8.76,53.59 7.59,53.59 C48.2 v7.49,54.74 | C46.1 v12.7,54.74 | v8,57.78 7.87,57.78 7.11,57.02 7.11,56.74 C47.2 | v20.7,49.53 R22.2 | U8.4 14.4,55.83 13.97,56.26 13.97,56.74 C45.1 13.08,56.77 v12.95,56.9 | C51.2 v9.91,58.8 | v31.62,61.59 31.45,61.42 U4.4 | v26.16,51.94 26.16,53.21 26.26,53.24 C13.1 | C20.2 27.3,65.41 v27.05,65.15 | v39.75,58.17 38.61,58.17 38.58,58.19 C19.2 | v33.27,81.15 INTAN.T6 | C2.2 v6.22,79.63 | C6.2 v16.89,79.63 | C16.2 29.06,82.7 29.08,82.68 v30.1,82.68 | S1.1 29.34,22.86 v29.34,24.13 29.34,25.4 S1.2 | C50.2 v18.41,55.63
  Top 0.61: C62.2 v8.76,8 | U15.4 6.73,15.3 v6.73,15.37
  Top 1.016: v34.92,41.78 33.28,41.78 C44.- | C43.- v44.32,41.78
  Bottom 0.254: C5.1 31.24,52.7 31.24,52.83
  Bottom 0.406: 14.73,76.71 C25.2 | v29.97,52.96 30.1,52.83 31.24,52.83 | 31.11,54.1 31.24,54.1 31.14,54.2 C4.1 30.35,54.23 v29.97,53.85 | C17.2 28.6,61.44 | C1.2 37.72,54.23 38.1,54.23 v38.73,53.59 | 37.59,52.58 C3.2 37.97,52.58 v38.73,51.82 | C53.2 v46.35,81.03 | C59.2 v44.83,80.9 44.2,80.26 42.8,80.26 42.29,80.77 U13.2 | C55.2 v46.35,75.69 | C58.2 v44.83,75.69 44.2,75.06 42.8,75.06 42.29,75.56 U12.2 | C54.2 v46.35,70.48 | C56.2 v44.83,70.48 44.2,69.85 42.8,69.85 42.29,70.36 U11.2 | C52.2 v46.35,65.28 | C57.2 v44.83,65.28 44.2,64.64 42.8,64.64 42.29,65.15 U10.2 | U14.5 46.35,56.41 C61.2 C60.2 45.34,53.85 v45.34,52.45 | v27.3,61.72 27.56,61.72 27.81,61.47 28.66,61.47 | C17.2 C18.2 | 28.7,61.47 28.66,61.47 | 28.66,61.47 C17.2
  Bottom 0.61: C27.2 8.38,76.83 7.87,77.34 v7.37,77.34 | C28.2 v8.38,70.23 | v15.75,77.34 15.37,77.34 14.73,76.71 | v19.81,77.47 C14.2 | v26.16,77.47 C10.2 | v14.73,70.23 C26.2 | v19.81,70.1 C15.2 | v26.16,70.1 C12.2
  other vias: 10.67,37.85 18.29,37.85 11.43,38.35 11.43,37.34 9.91,37.34 17.53,37.34 19.05,37.34 19.05,38.35 42.16,28.57 42.04,26.04 44.07,31.24 42.16,29.46 42.16,30.35 38.61,30.61 37.72,30.61 38.61,23.75 37.59,23.75 37.21,24.64 37.21,29.84 37.21,25.53 37.21,28.96 45.09,27.56 45.09,26.29 45.09,24.89 45.09,23.37 40.26,31.24 41.53,31.24 42.8,31.24 45.09,28.96 45.34,31.24
  pour Top (isolate 0.254, rank 3, no thermals): 6.73,47.24 20.57,47.24 20.57,28.7 6.73,28.7
  pour GND (rank 2, no thermals): 0,86.36 30.48,86.49 30.48,68.2 34.29,64.39 34.29,54.61 33.78,54.1 33.78,48.64 32.51,47.37 24.64,47.37 23.37,46.1 23.37,27.94 5.46,27.94 5.46,76.2 0,76.2
  pour GND (no thermals): 30.99,86.49 30.99,68.45 34.8,64.64 34.8,54.36 34.29,53.85 34.29,48.39 32.77,46.86 24.77,46.86 23.88,45.97 23.88,27.43 -0.13,27.43 -0.13,-0.13 54.86,-0.13 54.86,86.49
  pour GND (no thermals): 35.43,61.34 35.43,54.86 33.91,54.86 33.91,61.34
  pour Top (rank 3, no thermals): 45.97,32.51 45.97,22.23 36.7,22.23 36.7,32.51
  pour Bottom (isolate 0.254, no thermals): 30.99,86.49 30.99,68.45 34.8,64.64 34.8,54.36 34.29,53.85 34.29,48.39 32.77,46.86 24.77,46.86 23.88,45.97 23.88,27.43 -0.13,27.43 -0.13,-0.13 54.86,-0.13 54.86,86.49
I2C2_SCL  (via drill 0.33)
  Top 0.254: U15.6 9.14,10.23 v9.14,11.94 7.49,11.94 4.57,9.02 R30.1 | BB1.65 53.75,40.86 arc-45 53.98,40.32 53.98,31.11 53.59,30.73 v53.59,30.48 | SCLK.TP 14.99,13.97 v14.99,12.7
  Bottom 0.254: v53.59,30.48 53.59,30.23 53.98,29.84 53.98,17.02 52.45,15.49 41.78,15.49 36.32,20.95 15.62,20.95 14.99,20.32 v14.99,12.7 14.22,11.94 v9.14,11.94
I2C2_SDA  (via drill 0.33)
  Top 0.254: 7.62,7.37 7.62,9.97 U15.5 | SDA.TP 13.97,7.62 14.1,7.49 SDA.TP | SDA.TP 13.34,6.86 8.13,6.86 7.62,7.37 | 4.17,7.37 R31.1 7.49,7.49 7.62,7.37 | BB1.66 51.21,40.86 arc-45 51.44,40.32 v51.44,30.48 | v13.84,12.83 13.84,7.62 SDA.TP
  Bottom 0.254: v51.44,30.48 51.44,17.4 50.04,16 42.04,16 36.45,21.59 15.37,21.59 14.35,20.57 14.35,13.34 v13.84,12.83
MASTER/SLAVE  (via drill 0.33)
  Top 0.254: v45.09,60.83 45.09,62.42 arc-45 45.31,62.96 45.62,63.28 arc-45 46.16,63.5 50.36,63.5 arc45 50.9,63.72 51.21,64.04 arc45 51.44,64.58 51.44,68.26 arc-45 51.66,68.8 BB1.87
  Bottom 0.254: U14.2 43.81,63.37 43.94,63.5 44.96,63.5 45.09,63.37 U14.3 v45.09,60.83
MISO1_N  (via drill 0.33)
  Top 0.178: INTAN.T4 35.43,81.09 35.37,81.09 35.18,80.77 v35.18,80.01
  Bottom 0.178: v35.18,80.01 35.18,79.99 38.8,76.36 arc-45 39.03,75.83 39.03,68.23 arc45 39.25,67.69 arc45 39.4,67.63 39.84,67.63 R24.2 40.48,67.92 arc45 41.02,68.14 U10.4
MISO1_P  (via drill 0.33)
  Top 0.178: INTAN.B4 35.18,82.61 v35.18,83.19
  Bottom 0.178: v35.18,83.19 34.77,82.77 arc45 34.54,82.23 34.54,80.1 arc45 34.77,79.56 34.97,79.36 arc23 35.23,79.19 35.56,79.05 arc-23 35.82,78.89 38.47,76.23 arc-45 38.7,75.69 38.7,67.81 arc45 38.92,67.27 39.3,66.89 39.94,66.26 R24.1 40.16,66.17 40.45,66.17 arc-45 40.99,65.94 arc45 41.13,65.89 U10.3
MOSI_N  (via drill 0.33)
  Top 0.178: INTAN.T3 36.01,80.07 v36.07,80.01
  Bottom 0.178: v36.07,80.01 36.07,79.97 arc45 36.29,79.43 39.36,76.36 arc-45 39.59,75.82 39.59,73.53 arc45 39.81,72.99 40.31,72.49 arc45 40.85,72.26 arc-45 41.14,72.14 arc-45 41.35,71.64 U11.3 41.27,71.17
MOSI_P  (via drill 0.33)
  Top 0.178: INTAN.B3 36.01,83.76 v36.07,83.82
  Bottom 0.178: v36.07,83.82 36.07,81.98 arc45 36.29,81.44 36.48,81.25 arc-45 36.7,80.71 36.7,79.8 arc45 36.93,79.26 39.69,76.49 arc-45 39.92,75.95 39.92,73.66 arc45 40.14,73.12 40.4,72.87 arc45 40.94,72.64 arc45 41.08,72.7 41.13,72.75 arc45 41.35,73.29 U11.4 41.27,73.61
N$1
  Top 0.406: C35.1 arc90 18.29,31.41 18.29,34.29 17.96,34.62 U7.6
N$2
  Top 0.406: C34.1 10.67,31.33 10.67,34.29 10.34,34.62 U6.6
N$3
  Top 0.254: U2.22 30.86,57.53 30.99,57.66 31.37,57.66 31.52,57.51 U2.21
N$4
  Top 0.406: U9.5 9.07,51.94 | 9.07,51.94 7.52,51.94 C48.1 | 9.07,51.94 11.18,51.94 13.59,49.53 19.43,49.53 21.03,51.13 R21.2
N$7
  Top 0.203: U5.B1 42.49,27.76
  Top 0.254: 42.49,27.76 42.67,27.94
  Top 0.406: 42.67,27.94 43.03,28.3 R10.2 R11.1
N$8
  Top 0.406: R21.1 23.93,49.99 R22.1
N$9
  Top 0.305: U9.7 U9.6
  Top 0.406: U9.6 9.7,49.71 8.89,48.9 R23.2
N$10
  Top 0.406: R21.3 22.2,55.83 R20.2
N$14
  Top 0.254: S1.4 13.59,22.86 11.68,20.95 11.68,15.43 U15.1 11.43,15.17 11.43,13.97 10.67,13.21 5.18,13.21 R26.1
N$16
  Top 0.406: C13.2 28.35,55.3 R4.1 29.21,54.61 32.92,54.61 33.48,55.17 U2.18
N$17
  Top 0.203: U5.A2 43.2,26.67
  Top 0.254: 43.2,26.67 43.43,26.67
  Top 0.406: 43.43,26.67 43.46,26.64 R13.1 44.09,26.49 R12.2 C38.2
N$18
  Top 0.254: 10.41,15.17 10.41,14.48 9.65,13.72 4.17,13.72 R27.1 | 10.41,15.17 U15.2 | 10.41,15.17 10.41,23.5 12.32,25.4 S1.3
N$19
  Top 0.254: U15.3 8.89,15.43 8.89,16.64 8.64,16.89 4.7,16.89 4.06,16.26 4.06,15.14 R28.1
N$20
  Top 0.254: R18.1 53.09,6.55 arc-90 48.06,1.52 PWR.A
N$22
  Top 0.254: 10.16,12.7 6.2,12.7 R29.1 | 10.16,12.7 11.68,12.7 13.08,14.1 WP.TP | U15.7 10.16,10.23 10.16,12.7
N$23
  Top 0.203: U5.A1 43.2,27.69
  Top 0.254: 43.2,27.69 43.43,27.69
  Top 0.406: 43.43,27.69 44.07,27.69 R13.2
N$28
  Top 0.305: U9.3 9.7,55.8 10.03,56.13 10.03,56.62 R19.1 C47.1
N$32
  Top 0.406: C46.2 14.02,50.65 U8.5
N$40
  Top 0.254: C7.2 8.89,64.52 | 8.89,64.52 8.89,65.79 | R3.P1 10.25,65.79 8.89,65.79 | 8.89,64.52 9.02,64.52 9.78,63.75 9.78,59.94 11.05,58.67 16.89,58.67 18.67,56.9 23.43,56.9 25.15,55.18 25.15,51.79 26.14,50.8 U2.1 29.46,50.8 | 8.89,65.79 8,65.79 AIA+.TP
N$41
  Top 0.254: AIB+.TP 9.65,66.42 10.92,66.42 11.16,66.19 R3.P3 11.18,65.78 11.18,65.15 10.67,64.64 C8.2 10.82,64.49 11.56,63.75 11.56,60.45 12.83,59.18 17.4,59.18 19.18,57.4 24,57.4 25.78,55.63 25.78,54.77 arc90 26.07,54.48 26.77,54.48 arc-90 27.05,54.2 27.05,52.18 27.79,51.44 28.86,51.44 29.24,51.82 30.05,51.82 30.23,51.64 U2.2
N$42
  Top 0.254: AIC+.TP 13.46,66.42 12.19,66.42 11.96,66.19 R3.P5 11.94,65.78 11.94,65.15 12.45,64.64 C9.2 12.6,64.49 13.34,63.75 13.34,60.96 14.61,59.69 17.78,59.69 19.56,57.91 26.21,57.91 27.56,56.56 27.56,52.43 27.92,52.07 28.83,52.07 29.08,52.32 30.23,52.32 30.86,51.69 U2.3
N$43
  Top 0.254: 14.22,65.79 C11.2 14.38,64.49 15.11,63.75 15.11,61.47 15.88,60.71 18.54,60.71 20.19,59.05 26.54,59.05 28.45,57.15 29.57,57.15 U2.24 | R3.P7 12.87,65.79 14.22,65.79 | 14.22,65.79 15.11,65.79 AID+.TP
SCLK_N  (via drill 0.33)
  Top 0.178: INTAN.T2 36.7,81.09 36.7,81.03 36.83,80.9 36.83,80.52 v37.34,80.01
  Bottom 0.178: v37.34,80.01 37.34,79.84 arc45 37.56,79.3 39.2,77.66 arc45 39.74,77.43 40.49,77.43 arc-45 41.03,77.21 41.05,77.19 arc-45 41.27,76.65 41.27,76.38 U12.3
SCLK_P  (via drill 0.33)
  Top 0.178: INTAN.B2 36.83,82.61 v36.83,83.19
  Bottom 0.178: v36.83,83.19 37.88,82.14 arc-45 38.1,81.6 38.1,79.54 arc45 38.32,79 39.34,77.98 arc45 39.88,77.76 40.49,77.76 arc45 41.03,77.98 41.05,78.01 arc45 41.27,78.55 41.27,78.82 U12.4
SPI0
  Top 0.254: U2.11 36.07,50.23 arc45 36.29,49.69 36.35,49.63 arc45 36.89,49.4 47.18,49.4 arc45 47.72,49.63 BB1.74
SPI1
  Top 0.254: U4.13 39.77,61.42 arc45 40.3,61.64 42.7,64.04 arc-45 43.24,64.26 47.82,64.26 arc45 48.36,64.48 48.67,64.8 arc45 48.9,65.34 48.9,68.26 arc-45 49.12,68.8 BB1.88
SPI2  (via drill 0.33)
  Top 0.254: U2.10 35.43,50.1 arc45 35.66,49.56 36.73,48.48 arc45 37.27,48.26 v39.75,48.26 v51.44,48.26 | U4.12 34.72,60.76 v34.67,60.71
  Bottom 0.254: v34.67,60.71 34.67,59.24 arc45 34.89,58.7 35.21,58.39 arc45 35.75,58.17 36.39,58.17 arc-45 36.93,57.94 39.53,55.34 arc-45 39.75,54.8 v39.75,48.26 | v51.44,48.26 53.34,48.26 53.98,48.9 53.98,55.56 arc45 53.75,56.1 BB1.77
SPI3  (via drill 0.33)
  Top 0.254: U4.14 34.72,62.05 v34.67,62.1 | U2.12 39.44,50.8 arc45 39.97,51.02 40.29,51.34 arc45 40.51,51.88 v40.51,52.45 | BB1.75 51.53,55.78 arc45 50.99,56.01 42.48,56.01 arc-45 41.94,56.23 41.88,56.29 arc45 41.34,56.52 v40.51,56.52
  Bottom 0.254: v34.67,62.1 35.21,61.56 arc-45 35.43,61.02 35.43,59.28 arc45 35.59,58.9 arc45 36.13,58.67 36.64,58.67 arc-45 37.18,58.45 38.89,56.74 arc45 39.43,56.52 v40.51,56.52 v40.51,52.45
SPI4
  Top 0.254: U4.8 30.33,58.7 30.64,58.39 arc45 31.18,58.17 35.75,58.17 arc-45 36.29,57.94 36.48,57.75 arc-45 36.7,57.22 36.7,56.67 U2.13 37.65,55.72 arc45 38.19,55.5 40.2,55.5 arc-45 40.74,55.28 41.18,54.83 arc45 41.72,54.61 BB1.76
SPI5
  Top 0.254: U2.15 35.43,55.1 35.79,54.74 40.2,54.74 arc-45 40.74,54.51 41.94,53.31 arc45 42.48,53.09 49.28,53.09 49.53,53.34 51.12,53.34 arc-45 51.66,53.12 BB1.73
SPI6
  Top 0.254: U2.9 34.77,49.94 arc45 35,49.4 37.18,47.21 arc45 37.72,46.99 BB1.70
SPI7
  Bottom 0.254: BB1.63 53.75,40.42 arc45 53.98,40.96 53.98,44.96 53.09,45.85 49.72,45.85 arc-45 49.18,46.07 49.12,46.13 arc-45 48.9,46.67 48.9,82.5 arc45 48.67,83.04 47.17,84.54 arc45 46.63,84.76 43.93,84.76 arc45 43.39,84.54 43.23,84.38 U13.5
SPI8
  Bottom 0.254: U12.5 43.4,78.89 arc45 43.94,79.12 44.86,80.04 arc-45 45.4,80.26 47.31,80.26 arc-45 47.85,80.04 48.16,79.72 arc-45 48.39,79.19 48.39,45.53 arc45 48.61,44.99 48.93,44.67 arc45 49.47,44.45 BB1.68
SPI9
  Bottom 0.254: U11.5 43.4,73.69 arc45 43.94,73.91 44.73,74.71 arc-45 45.27,74.93 46.8,74.93 arc-45 47.34,74.71 47.66,74.39 arc-45 47.88,73.85 47.88,44.26 arc45 48.1,43.72 48.42,43.4 arc45 48.96,43.18 51.5,43.18 arc45 52.04,43.4 52.48,43.85 arc45 52.7,44.38 BB1.67
SPI10
  Bottom 0.254: U10.5 43.4,68.48 arc45 43.94,68.7 44.73,69.5 arc-45 45.27,69.72 46.29,69.72 arc-45 46.83,69.5 47.15,69.18 arc-45 47.37,68.64 47.37,40.45 arc45 47.59,39.91 47.91,39.59 arc45 48.45,39.37 BB1.64
SW
  Top 0.203: U5.D1 41.64,27.43 41.27,27.43
  Top 0.61: 41.27,27.43 41.15,27.56 40.64,27.56
  pour Top (rank 2, no thermals): 40.39,30.35 40.39,28.19 41.02,27.56 41.02,26.16 40.39,26.16 40.39,27.69 39.24,27.69 39.24,30.35
SYNC  (via drill 0.33)
  Top 0.254: BB1.71 53.75,50.58 arc45 53.98,51.12 53.98,59.76 arc45 53.75,60.29 53.44,60.61 arc45 52.9,60.83 v46.74,60.83
  Bottom 0.254: U14.1 42.55,63.37 43.18,64.01 45.72,64.01 46.35,63.37 U14.4 46.35,61.09 46.61,60.83 v46.74,60.83
SYNC_N
  Bottom 0.178: R25.2 42.97,59.08 arc-45 43.51,58.86 43.59,58.77 arc-45 43.81,58.23 U14.7 | SNYC.3 34.8,72.48 35.68,71.6 arc-45 35.9,71.06 35.9,67.3 arc-90 35.62,67.02 arc90 35.01,66.41 35.01,66.24 arc90 35.62,65.63 36.24,65.63 arc-90 36.52,65.35 36.52,65.19 arc-90 36.24,64.91 35.62,64.91 arc90 35.01,64.3 35.01,64.14 arc90 35.62,63.52 arc-90 35.9,63.25 35.9,61.97 arc45 36.13,61.43 36.41,61.15 arc45 36.95,60.92 39.31,60.92 arc-45 39.85,60.7 41.15,59.4 R25.2 | 41.02,59.27 R25.2
SYNC_P
  Bottom 0.178: R25.1 42.36,60.81 arc-45 42.9,60.58 44.86,58.62 arc-45 45.09,58.08 U14.6 | SNYC.4 37.34,72.48 36.46,71.6 arc45 36.23,71.06 36.23,67.3 arc-90 35.62,66.69 arc90 35.34,66.41 35.34,66.24 arc90 35.62,65.96 36.51,65.96 arc-90 37.12,65.35 37.12,65.19 arc-90 36.51,64.58 35.62,64.58 arc90 35.34,64.3 35.34,64.14 arc90 35.62,63.86 arc-90 36.23,63.25 36.23,62.11 arc45 36.46,61.57 36.55,61.48 arc45 37.09,61.25 39.5,61.25 arc-45 40.04,61.03 40.15,60.92 arc45 40.69,60.7 40.91,60.7 R25.1 | 41.02,60.62 R25.1
VBIAS  (via drill 0.33)
  Top 0.254: U1.3 7.89,74.56 | 7.87,73.28 8.74,73.28 U1.5 | U1.12 15.22,74.56 | 15.24,73.28 14.37,73.28 U1.10
  Top 0.406: R23.1 6.99,48.9 6.22,49.66 6.22,58.8 | 6.22,58.8 v6.22,60.45 6.22,73.28 | 6.22,73.28 6.22,74.55 | v16.76,62.87 VBIAS.TP 16.76,66.17 16.26,66.67 16.26,73.28 | 16.26,73.28 16.26,74.55 | 16.26,74.55 15.22,74.55 15.22,74.56 | 15.24,73.28 16.26,73.28 | 6.22,74.55 7.89,74.55 7.89,74.56 | 7.87,73.28 6.22,73.28 | C51.1 6.22,58.8 | 6.22,74.55 C2.1 | 16.26,74.55 16.64,74.55 16.89,74.8 C6.1
  Bottom 0.406: v6.22,60.45 15.87,60.45 16.76,61.35 v16.76,62.87
VDD_5V
  Top 0.203: U5.D2 41.27,26.56
  Top 0.254: R18.2 53.09,16.51 53.85,17.27 53.85,22.99 BB1.51
  Top 0.406: 41.27,26.56 41.27,26.04 40.13,24.89 C29.1 | R10.1 46.86,29.97
  Top 0.813: 40.01,23.88 40.01,24.87 C29.1
  Top 1.016: C43.+ 42.55,33.4 41.66,33.27 | 40.01,23.24 40.01,23.88
  Top 1.27: L2.1 34.04,31.75 35.56,33.27 41.66,33.27 45.59,33.27 46.86,32 46.86,29.97 46.86,24.13 | BB1.51 BB1.52 46.86,24.13 | 46.86,24.13 46.86,21.34 41.91,21.34 40.01,23.24
VDD_POST_LC  (via drill 0.33)
  Top 0.406: v16.26,35.56 17.22,35.56 U7.5 | v21.08,35.56 21.08,33.66 20.83,33.4 C31.1 | 19.43,35.56 19.36,35.56 U7.8
  Top 0.61: C31.1 19.94,35.2 19.58,35.56 19.43,35.56
  Top 1.016: L2.2 19.81,31.75 19.81,33.15 C31.1
  Bottom 0.406: v21.08,35.56 v16.26,35.56
  pour Top (rank 2, no thermals): 20.83,28.7 17.53,28.7 17.53,30.48 18.29,30.48 18.29,34.54 20.83,34.54
VDRIVE  (via drill 0.33, 0.9)
  Top 0.254: R31.2 v1.27,7.49 | v1.27,9.02 R30.2 | v1.27,10.54 R29.2 | v1.27,12.06 R26.2 | v1.27,13.59 R27.2 | v1.27,15.11 R28.2 | R8.2 40.01,63.25 39.5,62.74 v39.5,62.1 | R5.2 39.5,45.72 v39.5,44.58
  Top 0.406: 38.51,59.82 C19.1 | C19.1 38.63,59.94 38.73,59.82 v39.75,59.82 | 38.56,59.87 arc90 C19.1 | U4.11 38.41,60.12 arc-90 C19.1 | v34.92,54.23 34.77,54.23 U2.16 | v33.27,82.3 INTAN.B6
  Top 0.61: U15.8 11.56,8.04 C62.1 v12.57,8
  Top 1.016: v34.92,35.69 C44.+
  Bottom 0.406: C1.1 35.97,54.23 v34.92,54.23 34.92,53.4 35.49,52.83 C3.1 | U13.1 43.23,82.19 C59.1 C53.1 46.38,83.8 46.35,83.82 46.61,83.82 v47.5,82.93 | C55.1 46.38,78.49 | C55.1 C58.1 43.23,76.86 U12.1 | C54.1 46.38,73.28 | C54.1 C56.1 43.23,71.65 U11.1 | v46.35,79.5 C55.1 | U10.1 43.23,66.45 C57.1 C52.1 46.35,68.71 v45.97,69.09 | U14.8 42.55,56.41 C61.1 C60.1 43.56,53.85 v43.56,52.32 | v46.35,74.3 C54.1
  pour PWR (no thermals): 30.99,86.49 30.99,68.45 34.8,64.64 34.8,54.36 34.29,53.85 34.29,48.39 32.77,46.86 24.77,46.86 23.88,45.97 23.88,27.43 -0.13,27.43 -0.13,-0.13 54.86,-0.13 54.86,86.49
VOUT-  (via drill 0.33)
  Top 0.203: U5.B2 42.49,26.6
  Top 0.254: 42.49,26.6 42.67,26.42
  Top 0.406: 42.67,26.42 43.03,26.06 R12.1 C38.1 43.05,24.36 v43.05,23.5 | v40.13,26.04 39.91,26.26 D1.A
  Top 1.016: 37.95,27.43 C41.2
  Top 1.27: L1.1 33.91,28.83 35.31,27.43 37.95,27.43
  Bottom 0.61: v43.05,23.5 43.94,23.37 42.8,23.37 v40.13,26.04
  pour Top (no thermals): 40.01,27.3 38.99,27.3 38.99,28.19 36.7,28.19 36.7,26.16 38.86,26.16 38.86,26.8 40.01,26.8
VREF  (via drill 0.33)
  Top 0.305: U9.1 U9.2
  Top 0.406: R6.P2 R6.P4 | R6.P4 R6.P6 R6.P8 | R6.P4 22.99,79.19 | v18.92,52.7 19.81,53.59 19.81,55.37 20.45,56.13 R20.1 | v10.41,53.21 10.41,54.97 U9.2 | R4.2 26.54,55.4 v26.54,56.52 | C20.1 30.25,64.24 v30.35,64.14 30.35,63.4 U4.1 | VREF.TP 26.16,85.09 25.91,84.84 v25.91,82.68 C16.1 | 21.65,79.12 R6.P2 | v20.83,79.25 21.72,79.25 R6.P2
  Bottom 0.406: 22.99,63.63 22.99,60.07 v26.54,56.52 26.54,53.6 25.64,52.7 v18.92,52.7 10.92,52.7 v10.41,53.21 | 22.99,63.63 22.99,78.87 | 22.99,78.87 22.61,79.25 v20.83,79.25 | 22.99,63.63 28.83,63.63 29.34,64.14 v30.35,64.14 | v25.91,82.68 25.91,80.84 24.32,79.25 23.37,79.25 22.99,78.87
VREF_PRE
  Top 0.254: VREF_PRE.TP 17.27,56.01 17.02,55.75 17.02,52.2 16.89,52.07
  Top 0.406: C50.1 17.4,52.07 16.89,52.07 15.11,52.07 | 15.11,52.07 14.99,52.07 13.72,53.34 13.72,55.12 12.06,56.77 R19.2 | U8.6 15.11,50.72 15.11,52.07
VSS_POST_LC  (via drill 0.33)
  Top 0.406: v13.46,35.56 13.46,33.66 12.95,33.15
  Top 0.457: U6.8 11.68,35.61 11.68,33.78 | U6.5 9.6,35.56 v8.64,35.56
  Top 0.61: 12.95,33.15 C30.1
  Top 1.016: L1.2 22.73,28.83 22.23,28.32 12.57,28.32 12.32,28.57 12.32,29.46 11.94,29.84 10.64,29.84 C32.1
  Bottom 0.457: v8.64,35.56 v13.46,35.56
  pour Top (rank 2, no thermals): 13.21,28.7 9.91,28.7 9.91,30.48 10.67,30.48 10.67,34.54 13.21,34.54
~ADCRST
  Top 0.254: R5.1 37.74,45.82 34.51,49.05 arc-45 34.29,49.59 34.29,50.62 U2.8
~DACRST
  Top 0.254: 35.94,63.4 U4.16 36.83,63.37 36.96,63.25 36.96,63.12 | U4.15 36.8,62.71 36.96,62.87 36.96,63.12 | R8.1 38.12,63.12 36.96,63.12

### Text on the board
tPlace: puggleboard.com | PuggleBoard / Rev. 3.0 / Apr. 2014
bPlace: S/N: